# Altium project Reconfigurable_Test_Fixture.PrjPcb
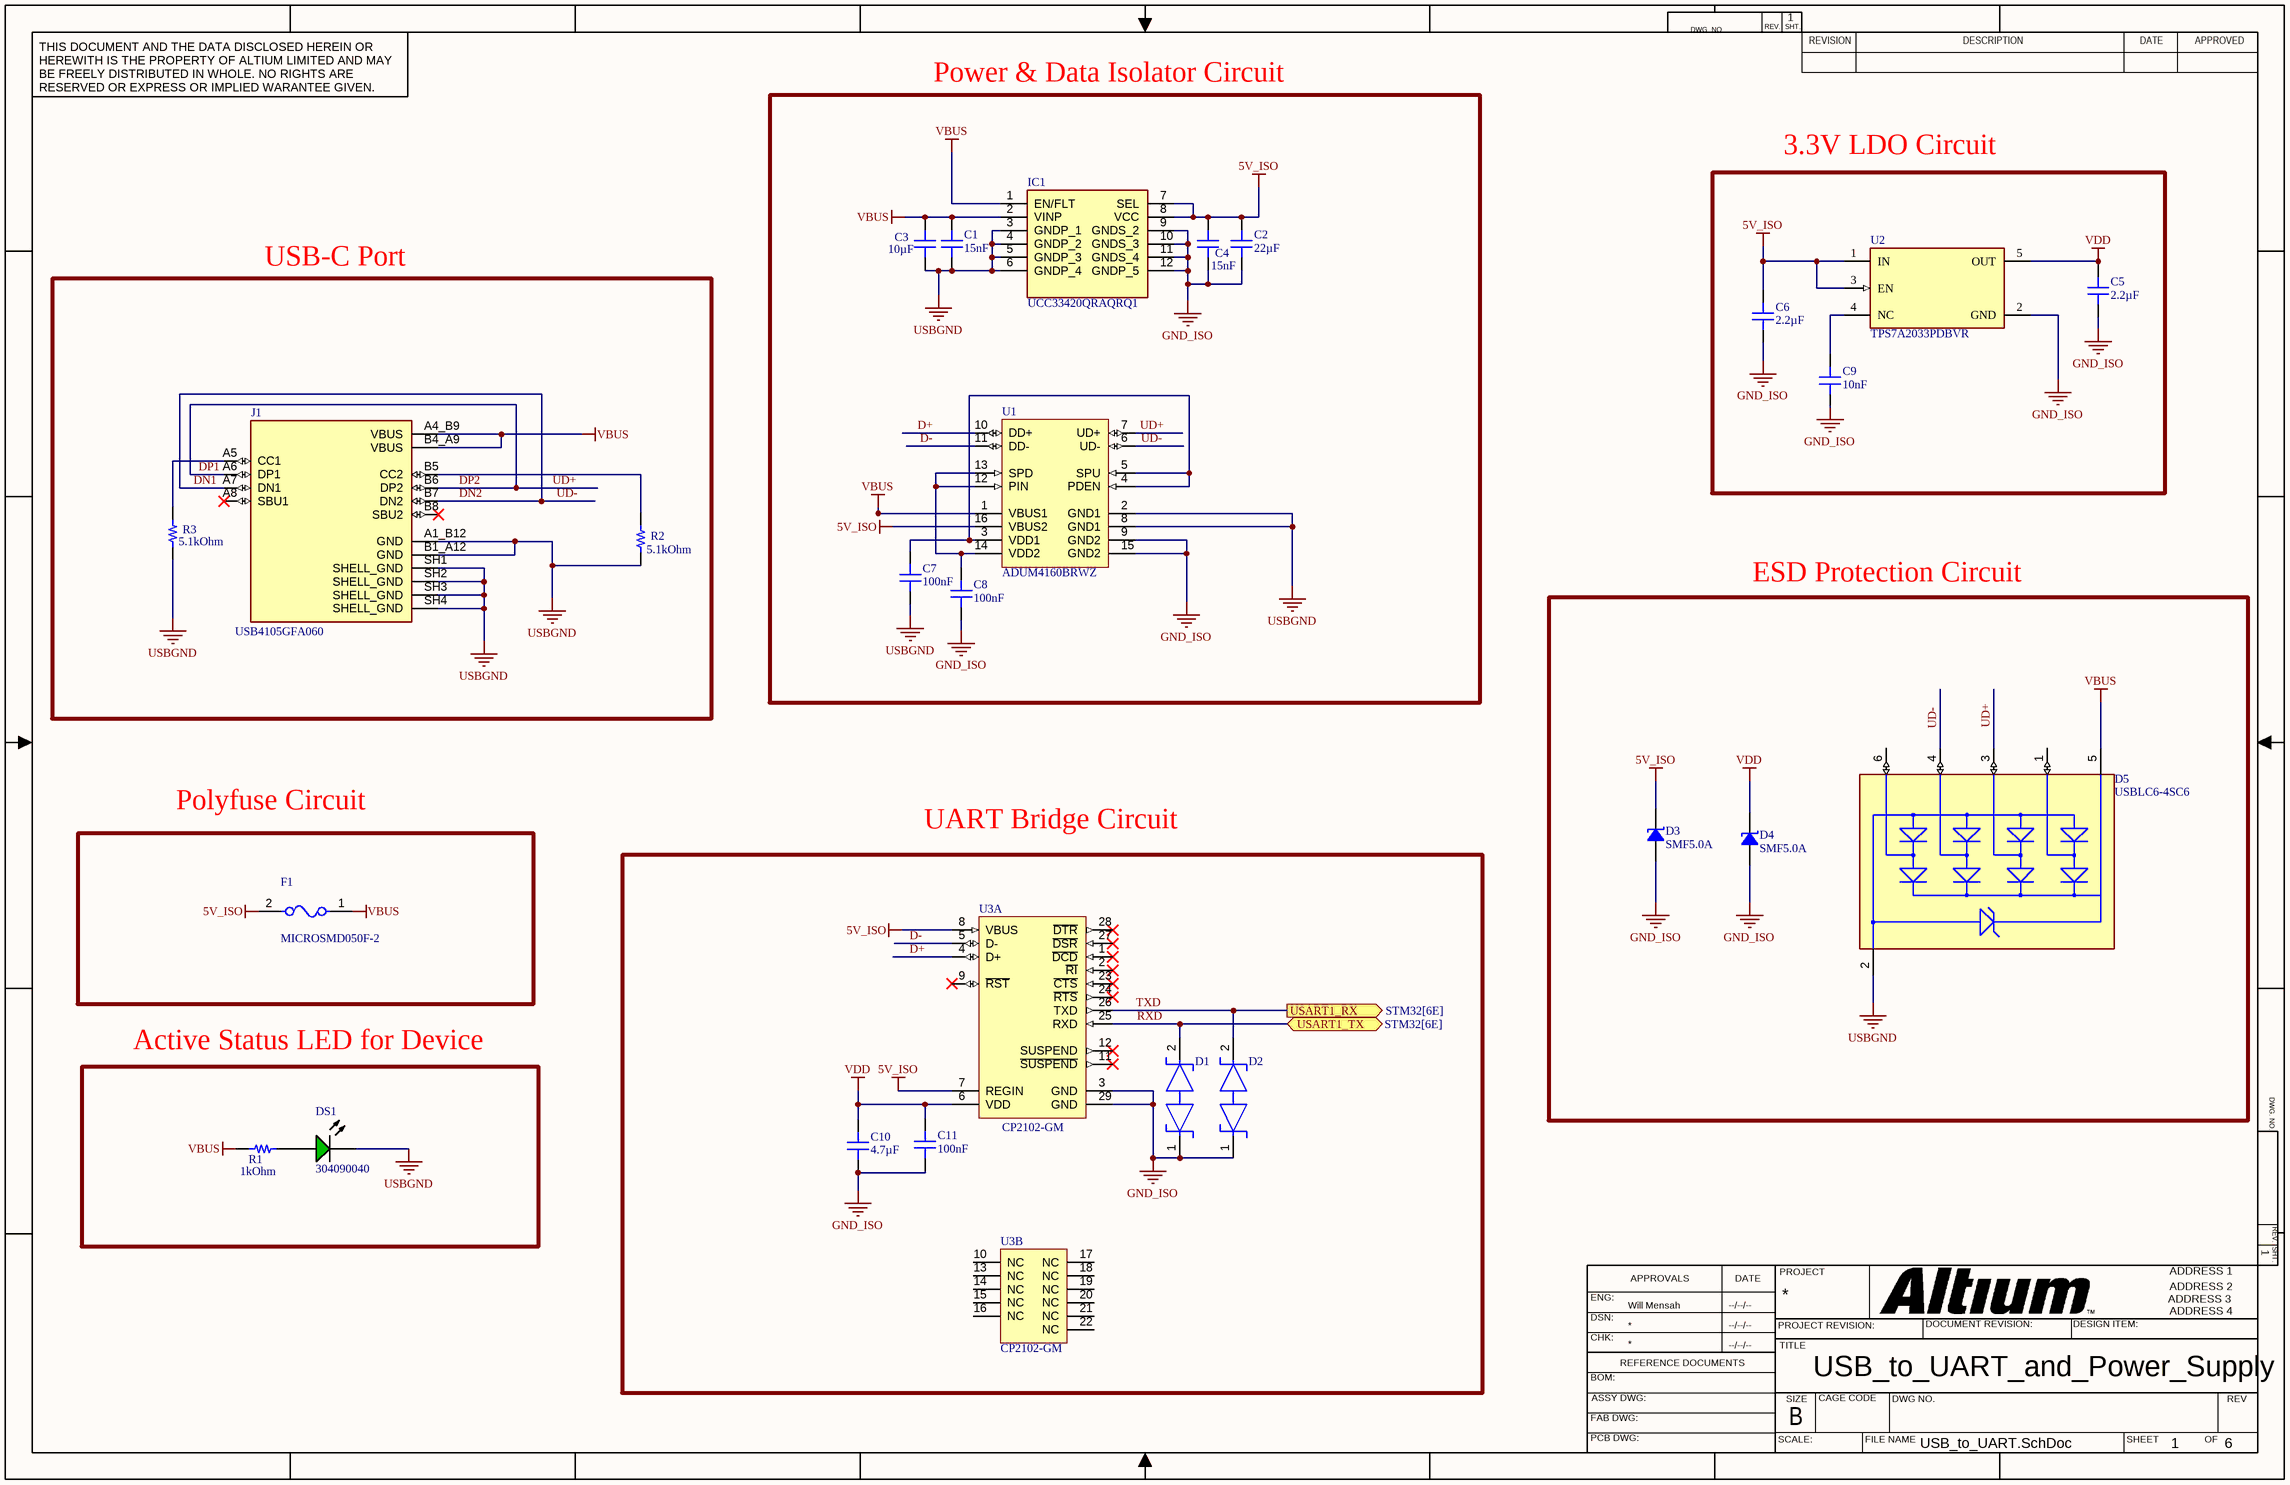
[diagram p0: USB_to_UART.SchDoc]
5 sheets, 107 parts. Net scope: flat (ports and power ports of the same name join across sheets).
Board file: PCB_1.PcbDoc
Sheets:
  USB_to_UART.SchDoc
  STM32.SchDoc
  Analog_Switch_Arrays.SchDoc
  Muxes_and_ADC.SchDoc
  Voltage_Reference_Circuit.SchDoc

## Sheet USB_to_UART.SchDoc: USB_to_UART_and_Power_Supply
size 431 x 279 mm; Engineer: Will Mensah; Organization: ORGANIZATION; Address1: ADDRESS 1; Address2: ADDRESS 2; Address3: ADDRESS 3; Address4: ADDRESS 4; Revision: -; SheetNumber: 1; SheetTotal: 6; ENG_APP_DATE: --/--/--; DSN_APP_DATE: --/--/--; CHK_APP_DATE: --/--/--

### Parts
C1  value 15nF  [CAP 1206_3216 - 0.8MM]  (hidden comment: 885342208013)
C2  value 22µF  [MURATA - GRM32E]  (hidden comment: GRM32ER71E226ME15L)
C3  value 10µF  [MURATA - GRM32E]  (hidden comment: GRM32ER71H106MA12L)
C4  value 15nF  [CAP 1206_3216 - 0.8MM]  (hidden comment: 885342208013)
C5  value 2.2µF  [MURATA CAP GCM31M 1206_3216]  (hidden comment: GCM31CL8EL225KE07L)
C6  value 2.2µF  [MURATA CAP GCM31M 1206_3216]  (hidden comment: GCM31CL8EL225KE07L)
C7  value 100nF  [MURATA CAP GCM31M 1206_3216]  (hidden comment: GCM31C5C1H104FA16L)
C8  value 100nF  [MURATA CAP GCM31M 1206_3216]  (hidden comment: GCM31C5C1H104FA16L)
C9  value 10nF  [MURATA CAP GRM31B 1206_3216]  (hidden comment: GRM31B7U2E103JW31L)
C10  value 4.7µF  [MURATA GRM21B 0805_2012]  (hidden comment: GRM21BR71A475KE51L)
C11  value 100nF  [MURATA CAP GCM31M 1206_3216]  (hidden comment: GCM31C5C1H104FA16L)
D1  TPD1E10B06DPYR  [FP-DPY0002A-MFG]  (value not drawn)
D2  TPD1E10B06DPYR  [FP-DPY0002A-MFG]  (value not drawn)
D3  SMF5.0A  [SOD123F]
D4  SMF5.0A  [SOD123F]
D5  USBLC6-4SC6  [FP-SOT23-6L-MFG]
DS1  304090040  [LED-2P-2.28-3MM]
F1  MICROSMD050F-2  [FP-microSMD-MFG]
IC1  UCC33420QRAQRQ1  [UCC33020QRAQRQ1]
J1  USB4105GFA060  [GCT_USB4105GFA060]
R1  1kOhm  [YAGEO RES 1206_3216]
R2  5.1kOhm  [YAGEO RES 1206_3216]
R3  5.1kOhm  [YAGEO RES 1206_3216]
U1  ADUM4160BRWZ  [RW-16_L]
U2  TPS7A2033PDBVR  [FP-DBV0005A-MFG]
U3  CP2102-GM  [SLAB-QFN-28-3125x3125TP_N]  (parts A,B of 2)

### Blocks framed on the sheet
Power & Data Isolator Circuit: C1-C4 C7 C8 IC1 U1
3.3V LDO Circuit: C5 C6 C9 U2
USB-C Port: J1 R2 R3
ESD Protection Circuit: D3-D5
Polyfuse Circuit: F1
UART Bridge Circuit: C10 C11 D1 D2 U3
Active Status LED for Device: DS1 R1

### Ports
USART1_RX (out, see STM32[6E]), USART1_TX (bidir, see STM32[6E])

### Nets
5V_ISO: C2.2 C4.2 C6.2 D3.2 F1.2 IC1.7(SEL) IC1.8(VCC) U1.16(VBUS2) U2.1(IN) U2.3(EN) U3.7(REGIN) U3.8(VBUS)
GND_ISO: C2.1 C4.1 C5.1 C6.1 C8.1 C9.1 C10.1 C11.1 D1.1 D2.1 D3.1 D4.1 IC1.9(GNDS_2) IC1.10(GNDS_3) IC1.11(GNDS_4) IC1.12(GNDP_5) U1.9(GND2) U1.15(GND2) U2.2(GND) U3.3(GND) U3.29(GND)
USBGND: C1.1 C3.1 C7.1 D5.2(GND) DS1.2(K) IC1.3(GNDP_1) IC1.4(GNDP_2) IC1.5(GNDP_3) IC1.6(GNDP_4) J1.A1_B12(GND) J1.B1_A12(GND) J1.SH1(SHELL_GND) J1.SH2(SHELL_GND) J1.SH3(SHELL_GND) J1.SH4(SHELL_GND) R2.1 R3.2 U1.2(GND1) U1.8(GND1)
VBUS: C1.2 C3.2 D5.5(VBUS) F1.1 IC1.1(EN/FLT) IC1.2(VINP) J1.A4_B9(VBUS) J1.B4_A9(VBUS) R1.2 U1.1(VBUS1)
VDD: C5.2 C10.2 C11.2 D4.2 U2.5(OUT) U3.6(VDD)
D+: U1.10(DD+) U3.4(D+)
D-: U1.11(DD-) U3.5(D-)
DN1: D5.4(I/O3) J1.A7(DN1) J1.B7(DN2) U1.6(UD-)  [also labelled DN2, UD-]
DP1: D5.3(I/O2) J1.A6(DP1) J1.B6(DP2) U1.7(UD+)  [also labelled DP2, UD+]
RXD: D1.2 U3.25(RXD) ; port USART1_TX
TXD: D2.2 U3.26(TXD) ; port USART1_RX
NetC7_2: C7.2 U1.3(VDD1) U1.4(PDEN) U1.5(SPU)
NetC8_2: C8.2 U1.12(PIN) U1.13(SPD) U1.14(VDD2)
NetC9_2: C9.2 U2.4(NC)
NetDS1_1: DS1.1(A) R1.1
NetJ1_A5: J1.A5(CC1) R3.1
NetJ1_B5: J1.B5(CC2) R2.2

Not connected (* = marked no-connect by the designer): D5 1(I/O1) 6(I/O4); J1 A8(SBU1)* B8(SBU2)*; U3 1(~{DCD})* 2(~{RI})* 9(~{RST})* 10(NC) 11(~{SUSPEND})* 12(SUSPEND)* 13(NC) 14(NC) 15(NC) 16(NC) 17(NC) 18(NC) 19(NC) 20(NC) 21(NC) 22(NC) 23(~{CTS})* 24(~{RTS})* 27(~{DSR})* 28(~{DTR})*

### Notes on the sheet
- DWG. NO.
- REV.
- SHT.
- THIS DOCUMENT AND THE DATA DISCLOSED HEREIN OR HEREWITH IS THE PROPERTY OF ALTIUM LIMITED AND MAY BE FREELY DISTRIBUTED IN WHOLE. NO RIGHTS ARE RESERVED OR EXPRESS OR IMPLIED WARANTEE GIVEN.
- REVISION
- DESCRIPTION
- DATE
- APPROVED
- ENG:
- APPROVALS
- PROJECT
- DSN:
- CHK:
- REFERENCE DOCUMENTS
- PROJECT REVISION:
- TITLE
- DOCUMENT REVISION:
- DESIGN ITEM:
- BOM:
- FAB DWG:
- PCB DWG:
- ASSY DWG:
- SCALE:
- SIZE
- B
- CAGE CODE
- FILE NAME
- DWG NO.
- SHEET
- OF
- REV

### Library data of the parts
C1 C4 = CMP-001-059796-1: CAP CER 15000PF 630V X7R 1206; Part Number: 885342208013
C2 = CMP-001-068110-1: CAP CER 22UF 25V X7R 1210; Part Number: GRM32ER71E226ME15L
C3 = CMP-001-068673-1: CAP CER 10UF 50V X7R 1210; Part Number: GRM32ER71H106MA12L
C5 C6 = CMP-001-063237-1: CAP CER 2.2UF 100V X8L 1206; Part Number: GCM31CL8EL225KE07L
C7 C8 C11 = CMP-001-060542-1: CAP CER 0.1UF 50V C0G/NP0 1206; Part Number: GCM31C5C1H104FA16L
C9 = CMP-001-062663-1: CAP CER 10000PF 250V U2J 1206; Part Number: GRM31B7U2E103JW31L
C10 = CMP-001-052117-1: CAP CER 4.7UF 10V X7R 0805; Part Number: GRM21BR71A475KE51L
D1 D2 = CMP-0326-00004-4: TVS DIODE 5.5V 14V 2X1SON; Manufacturer: Texas Instruments; Leakage Current: 100nA; Min Breakdown Voltage: 6V; Number of Channels: 1; ESD Protection: Yes; Power Line Protection: No; Test Current: 1mA; Interface: GPIO; Element Configuration: Single; Peak Pulse Current: 5A; Direction: Bidirectional; Peak Pulse Power: 90W; Capacitance: 12pF; Composition: Zener; Packaging: Tape and Reel; Number of Pins: 2; Breakdown Voltage: 6V; Radiation Hardening: No; Min Operating Temperature: -40°C; Contact Plating: Gold; Lead Free: Lead Free; Height: 0.35mm; REACH SVHC: No SVHC; Case/Package: 0402; Max Operating Temperature: 125°C; Width: 0.7mm; Clamping Voltage: 14V; Package Quantity: 1; Max Reverse Leakage Current: 100nA; Working Voltage: 5.5V; Length: 1.1mm; Number of Bidirectional Channels: 1; Reverse Standoff Voltage: 5.5V; PartNumber: TPD1E10B06DPYR
D3 D4 = CMP-004-19987-1: TVS SOD123FL 5V 200W UNIDIR; Part Number: SMF5.0A
D5 = CMP-2000-07370-2: TVS DIODE 5.25V 17V SOT23-6; Manufacturer: STMicroelectronics; Peak Pulse Power: 130W; Breakdown Voltage: 6V; Value: 3pF; Direction: Unidirectional; Interface: USB,Ethernet,Other; Number Of Channels: 4; Standoff Height: 0mm; Max Junction Temp: +125°C; Digikey Description: TVS DIODE 5.25V 17V SOT23-6; Automotive: No; Package: SOT23-6L; Mouser Description: USBLC6 Series 4 Line 6 V Uni / Bi-Directional ESD Protection - SOT-23-6; Octopart: https://octopart.com/usblc6-4sc6-stmicroelectronics-347147; RoHS: TRUE; ComponentLink2URL: https://upverter.com/datasheet/23dc4ffb028d868909e80577610284b194f13213.pdf; ComponentLink2Description: Datasheet; Device Class L1: Circuit Protection; Lead Free: Yes; Temperature Range High: +125°C; Device Class L2: ESD and Circuit Protection ICs; Device Class L3: unset; Capacitance: 3pF; Height: 1.45mm; Temperature Range Low: -40°C; Manufacturer Part Number: USBLC6-4SC6; Temperature: -40°C to +125°C; Category: Diode; Clamping Voltage: 17V
DS1 = CMP-007-00006-2: Green LED, 80 mW, 20 mA, -25 to 85 degC, 2-Pin THD; Manufacturer: Shenzhen CGX; Manufacturer URL: http://szcgx.com/; Package Reference: 304090040; Datasheet Version: Rev. 1.0, 09/2014; RoHS Compliant: Unknown; Case/Package: 304090040; Package Description: 2-Pin Through Hole Device, Dia 3 mm, Pitch 2.28 mm; Datasheet URL: http://datasheet.octopart.com/304090040-Chengguangxing-datasheet-62330655.pdf; Mounting Technology: TH
F1 = CMP-08606-000015-1: PTC RESET FUSE 13.2V 500MA 1210; Manufacturer: Littelfuse; Hold Current: 0.5A; Resistance: 0.25-0.9Ω; Trip Time: 0.05s; Value: 0.25-0.9Ω; Trip Current: 1A; Current Rating: 40A; Device Class L3: unset; ComponentLink2URL: https://www.littelfuse.com/~/media/electronics/datasheets/resettable_ptcs/littelfuse_ptc_microsmd_datasheet.pdf.pdf; Temperature: to +85°C; ComponentLink2Description: Datasheet; RoHS: TRUE; Category: Fuse; Ambient Temperature Range Low: -40°C; Lead Free: Yes; Device Class L1: Circuit Protection; Manufacturer Part Number: MICROSMD050F-2; Temperature Range High: +85°C; Ambient Temperature Range High: +85°C; Automotive: No; Height: 0.62mm; Digikey Description: PTC RESET FUSE 13.2V 500MA 1210; Voltage Rating: 13.2V; Package: microSMD; Octopart: https://octopart.com/microsmd050f-2-littelfuse-74214982; Device Class L2: PTC Resettable Fuses
IC1 = UCC33420QRAQRQ1: Integrated Circuit; Manufacturer_Name: Texas Instruments; Datasheet Link: https://www.ti.com/lit/ds/symlink/ucc33420-q1.pdf?ts=1741595347894&ref_url=https%253A%252F%252Fwww.ti.com%252Fproduct%252FUCC33420-Q1; Height: 1.05mm; Manufacturer_Part_Number: UCC33420QRAQRQ1; Mouser Part Number: 595-UCC33420QRAQRQ1; Mouser Price/Stock: https://www.mouser.co.uk/ProductDetail/Texas-Instruments/UCC33420QRAQRQ1?qs=7%2F6SraaimPSitAwgIt4uJA%3D%3D; Arrow Part Number: UCC33420QRAQRQ1; Arrow Price/Stock: https://www.arrow.com/en/products/ucc33420qraqrq1/texas-instruments?utm_currency=USD&region=nac
J1 = CMP-002-00267-1: USB-C (USB TYPE-C) USB 2.0 Receptacle Connector 24 (16+8 Dummy) Position Surface Mount, Right Angle; Through Hole; MF: Global Connector Technology; Check_prices: https://www.snapeda.com/parts/USB4105GFA060/Global+Connector+Technology/view-part/?ref=eda; Component Type: Standard; Source: USB4105GFA060.SchLib; SnapEDA_Link: https://www.snapeda.com/parts/USB4105GFA060/Global+Connector+Technology/view-part/?ref=snap; Pins: 16; Case/Package: None; Design Item ID: USB4105GFA060; Value: *; MP: USB4105GFA060
R1 = CMP-009-085524-1: RES 1K OHM 1% 1/4W 1206; Part Number: RC1206FR-101KL
R2 R3 = CMP-009-086345-1: RES 5.1K OHM 0.1% 1/4W 1206; Part Number: RP1206BRD075K1L
U1 = CMP-0534-00647-1: Full/Low Speed USB Digital Isolator, 2 Channels, 5 kV rms, 3.1 to 5.5 V, -40 to 105 degC, 16-Pin SOIC (RW-16), RoHS, Tube; Manufacturer: Analog Devices; IDD@12 Mbps: 8 mA Max.; Number of Channels: 2; Data Rate: 12 Mbps Max.; CIN: 10 pF Typ.; Voltage Isolation: 5 kVrms; DatasheetVersion: Rev. D; VBUS: 3.1 to 5.5 V; PartNumber: ADUM4160BRWZ; Temperature Range: -40 to 105 degC; Mounting Technology: Surface Mount; PackageDescription: 16-Pin Small Outline Integrated Circuit, Body 10.3 x 7.5 mm, Pitch 1.27 mm; ComponentLink2URL: http://www.analog.com/static/imported-files/data_sheets/ADuM4160.pdf; PackageVersion: Mar-07; ComponentLink2Description: Datasheet; ComponentLink1URL: http://www.analog.com/en/index.html; Packing: Tube; ComponentLink3URL: http://www.analog.com/static/imported-files/packages/PKG_PDF/SOIC_WIDE%20(RW)/RW_16.pdf; RoHS: TRUE; ComponentLink3Description: Package Specification; ComponentLink1Description: Manufacturer URL
U2 = CMP-04917-000300-1: IC REG LINEAR 3.3V 300MA SOT23-5; RoHS Compliant: Yes
U3 = CMP-0511-00012-1: Single-Chip USB to UART Bridge, 1024 Bytes EEPROM, -40 to 85 degC, 28-pin QFN, Tube; Manufacturer: Silicon Labs; Internal Oscillator: TRUE; Sub-Family: USB Bridges; ComponentLink3Description: Package Specification; PackageDescription: 28-Pin Quad-Flat No-Leads Package, Body 5 x 5 mm, Pitch 0.5 mm; PartNumber: CP2102-GM; EEPROM: 1024 Bytes; Mounting Technology: Surface Mount; ComponentLink2URL: http://www.silabs.com/Support%20Documents/TechnicalDocs/CP2102-9.pdf; DatasheetVersion: Rev. 1.5; ComponentLink1URL: http://www.silabs.com/; ComponentLink2Description: Datasheet; Code_JEDEC: MO-220; PackageReference: QFN-28; Code_IPC: J-STD-020C; ComponentLink3URL: http://www.silabs.com/Support%20Documents/TechnicalDocs/C8051T61x.pdf; ComponentLink1Description: Manufacturer URL

## Sheet STM32.SchDoc: STM32_and_Reference_Voltage_Circuits
size 431 x 279 mm; DrawnBy: Will Mensah; SheetNumber: 2; SheetTotal: 6
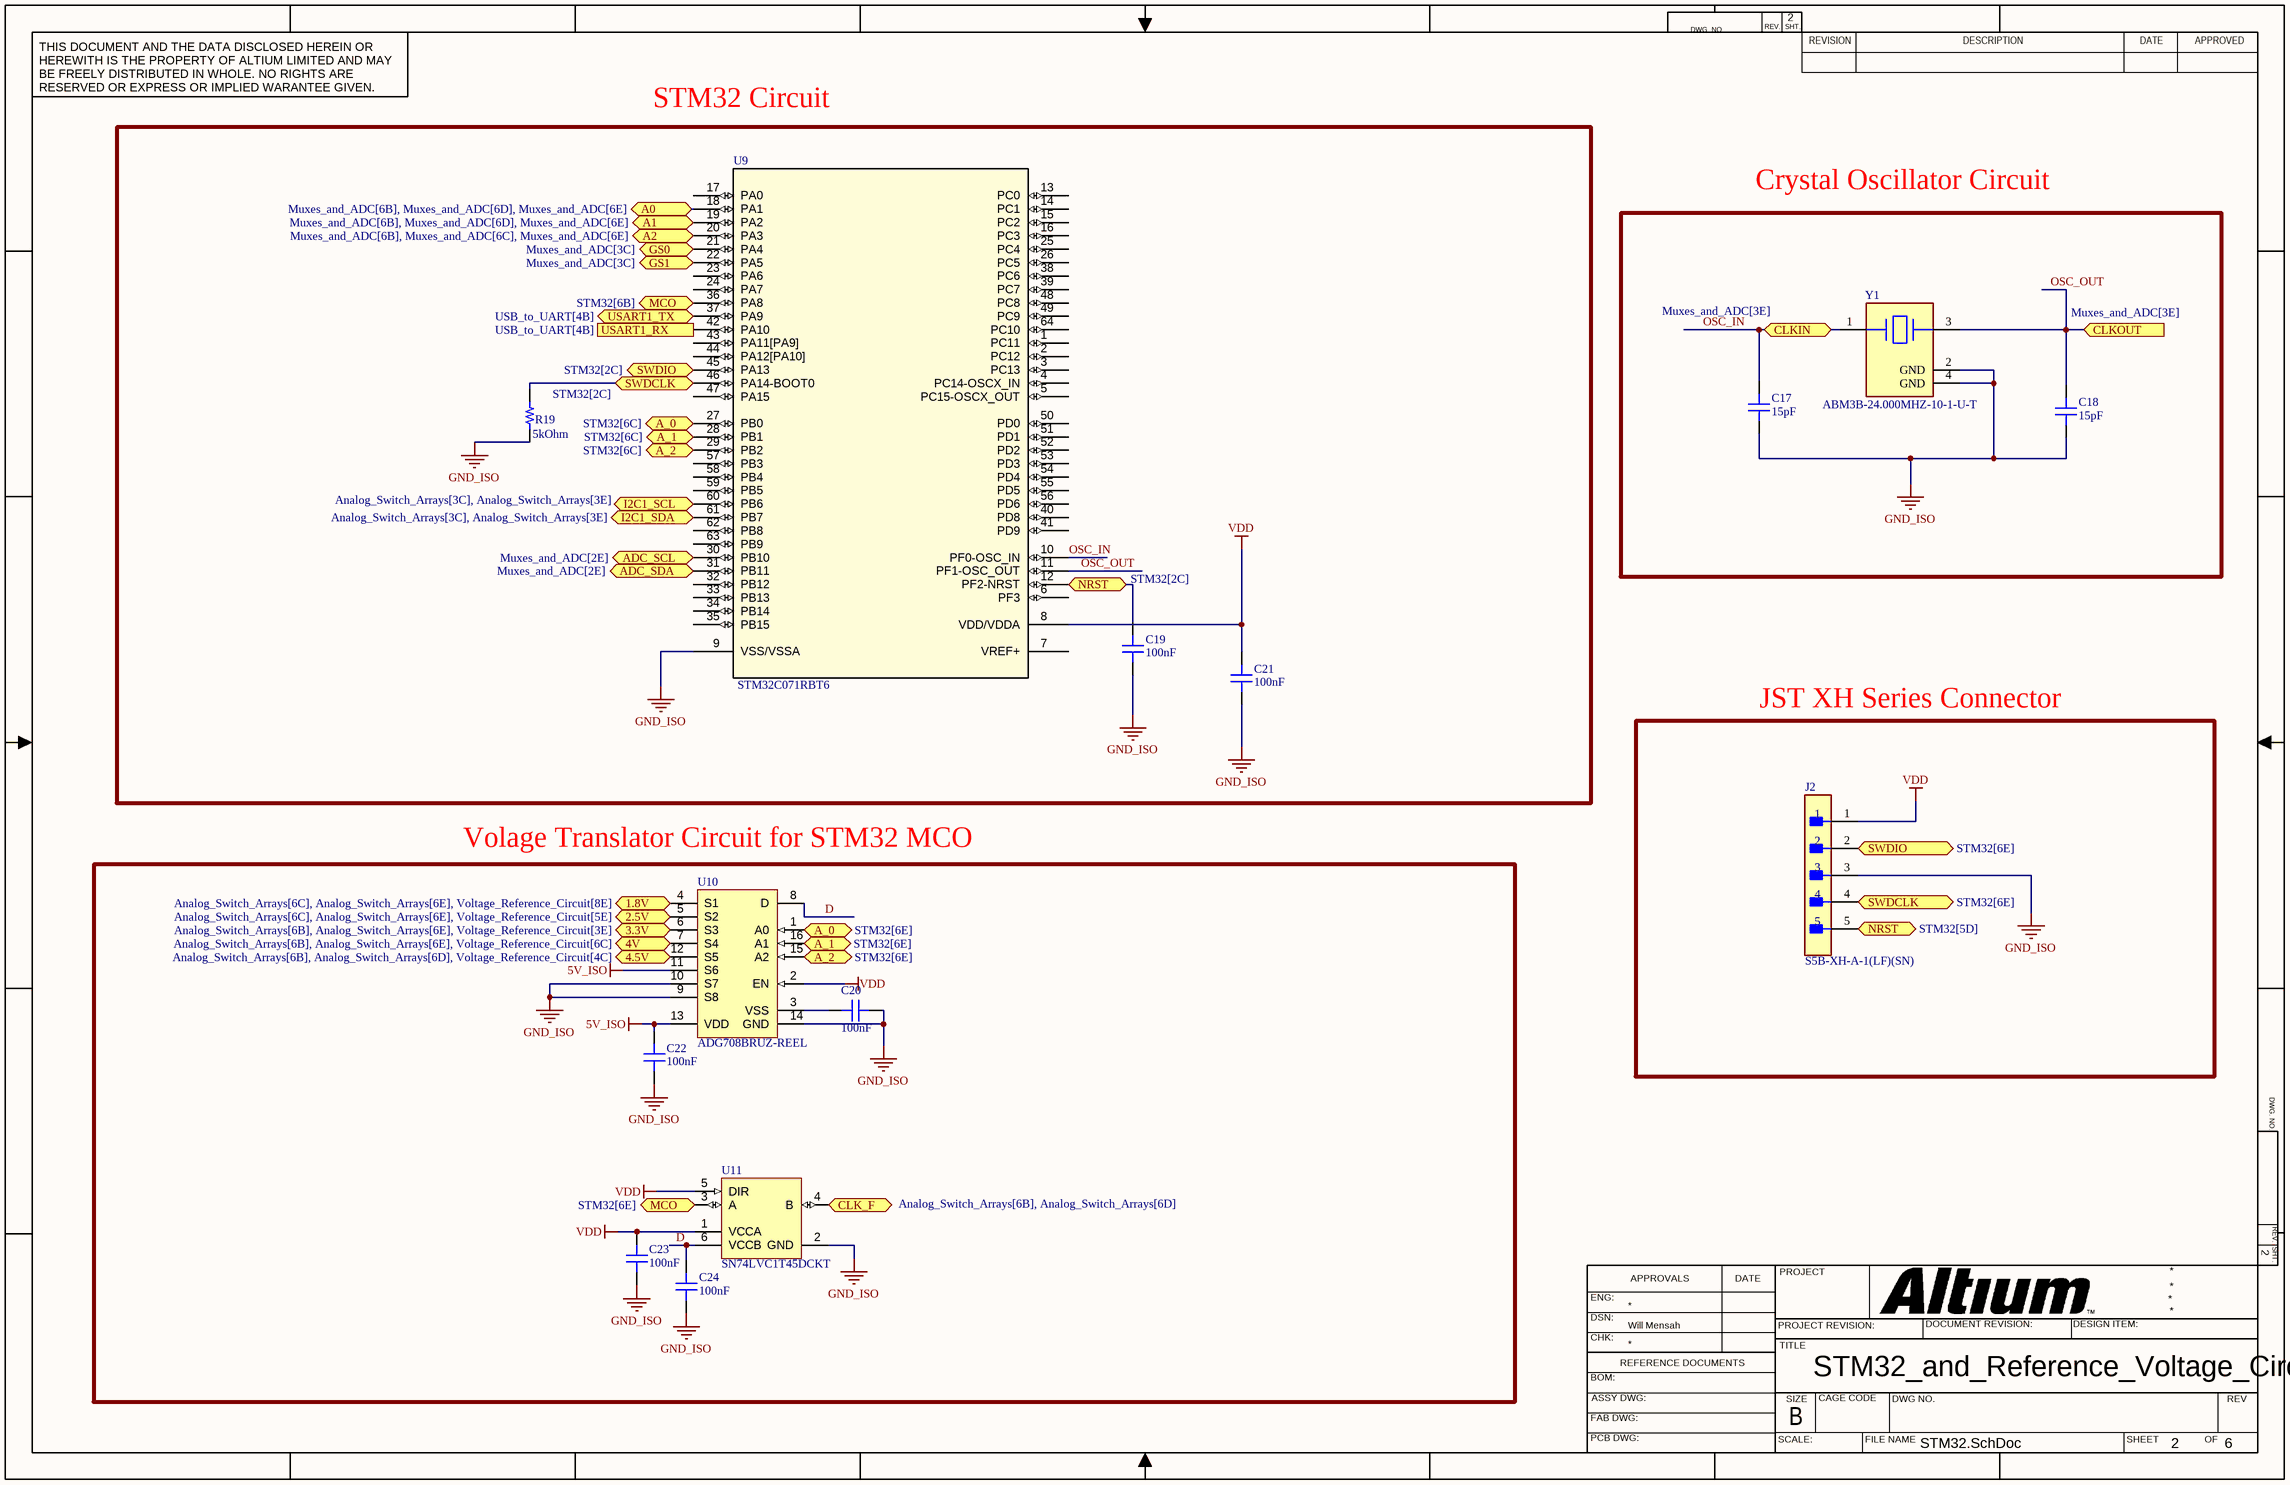
[diagram p1: STM32.SchDoc]

### Parts
C17  value 15pF  [MURATA CAP GRM31A 1206_3216]  (hidden comment: GRM31A5C2H150JW01D)
C18  value 15pF  [MURATA CAP GRM31A 1206_3216]  (hidden comment: GRM31A5C2H150JW01D)
C19  value 100nF  [MURATA CAP GCM31M 1206_3216]  (hidden comment: GCM31C5C1H104FA16L)
C20  value 100nF  [CAP 1206_3216 - 0.8MM]  (hidden comment: C1206X104G4HAC7800)
C21  value 100nF  [MURATA CAP GCM31M 1206_3216]  (hidden comment: GCM31C5C1H104FA16L)
C22  value 100nF  [CAP 1206_3216 - 0.8MM]  (hidden comment: C1206X104G4HAC7800)
C23  value 100nF  [CAP 1206_3216 - 0.8MM]  (hidden comment: C1206X104G4HAC7800)
C24  value 100nF  [CAP 1206_3216 - 0.8MM]  (hidden comment: C1206X104G4HAC7800)
J2  S5B-XH-A-1(LF)(SN)  [FP-S5B-XH-A-1_LF_SN-MFG]
R19  5kOhm  [YAGEO RES 1206_3216]
U9  STM32C071RBT6  [LQFP-64_STM]
U10  ADG708BRUZ-REEL  [ADI-RU-16_N]
U11  SN74LVC1T45DCKT  [DCK0006A_N]
Y1  ABM3B-24.000MHZ-10-1-U-T  [FP-ABM3B-MFG]

### Blocks framed on the sheet
STM32 Circuit: C19 C21 R19 U9
Crystal Oscillator Circuit: C17 C18 Y1
JST XH Series Connector: J2
Volage Translator Circuit for STM32 MCO: C20 C22-C24 U10 U11

### Ports
1.8V (bidir, see Analog_Switch_Arrays[6C], Analog_Switch_Arrays[6E], Voltage_Reference_Circuit[8E]), 2.5V (bidir, see Analog_Switch_Arrays[6C], Analog_Switch_Arrays[6E], Voltage_Reference_Circuit[5E]), 3.3V (bidir, see Analog_Switch_Arrays[6B], Analog_Switch_Arrays[6E], Voltage_Reference_Circuit[3E]), 4.5V (bidir, see Analog_Switch_Arrays[6B], Analog_Switch_Arrays[6D], Voltage_Reference_Circuit[4C]), 4V (bidir, see Analog_Switch_Arrays[6B], Analog_Switch_Arrays[6E], Voltage_Reference_Circuit[6C]), A0 (bidir, see Muxes_and_ADC[6B], Muxes_and_ADC[6D], Muxes_and_ADC[6E]), A1 (bidir, see Muxes_and_ADC[6B], Muxes_and_ADC[6D], Muxes_and_ADC[6E]), A2 (bidir, see Muxes_and_ADC[6B], Muxes_and_ADC[6C], Muxes_and_ADC[6E]), A_0 (bidir, see STM32[6C]), A_0 (bidir, see STM32[6E]), A_1 (bidir, see STM32[6C]), A_1 (bidir, see STM32[6E]), A_2 (bidir, see STM32[6C]), A_2 (bidir, see STM32[6E]), ADC_SCL (bidir, see Muxes_and_ADC[2E]), ADC_SDA (bidir, see Muxes_and_ADC[2E]), CLK_F (bidir, see Analog_Switch_Arrays[6B], Analog_Switch_Arrays[6D]), CLKIN (bidir, see Muxes_and_ADC[3E]), CLKOUT (in, see Muxes_and_ADC[3E]), GS0 (bidir, see Muxes_and_ADC[3C]), GS1 (bidir, see Muxes_and_ADC[3C]), I2C1_SCL (bidir, see Analog_Switch_Arrays[3C], Analog_Switch_Arrays[3E]), I2C1_SDA (bidir, see Analog_Switch_Arrays[3C], Analog_Switch_Arrays[3E]), MCO (bidir, see STM32[6B]), MCO (bidir, see STM32[6E]), NRST (bidir, see STM32[2C]), NRST (bidir, see STM32[5D]), SWDCLK (bidir, see STM32[2C]), SWDCLK (bidir, see STM32[6E]), SWDIO (bidir, see STM32[2C]), SWDIO (bidir, see STM32[6E]), USART1_RX (in, see USB_to_UART[4B]), USART1_TX (bidir, see USB_to_UART[4B])

### Nets
5V_ISO: C22.1 U10.11(S6) U10.13(VDD)
GND_ISO: C17.1 C18.2 C19.1 C20.2 C21.1 C22.2 C23.1 C24.1 J2.3 R19.1 U9.9(VSS/VSSA) U10.9(S8) U10.10(S7) U10.14(GND) U11.2(GND) Y1.2(GND) Y1.4(GND)
VDD: C21.2 C23.2 J2.1 U9.8(VDD/VDDA) U10.2(EN) U11.1(VCCA) U11.5(DIR)
2Y0: U10.4(S1) ; port 1.8V
2Y1: U10.5(S2) ; port 2.5V
2Y2: U10.6(S3) ; port 3.3V
2Y3: U10.7(S4) ; port 4V
2Y4: U10.12(S5) ; port 4.5V
2Y6: U11.4(B) ; port CLK_F
D: C24.2 U10.8(D) U11.6(VCCB)
OSC_IN: C17.2 U9.10(PF0-OSC_IN) Y1.1 ; port CLKIN
OSC_OUT: C18.1 U9.11(PF1-OSC_OUT) Y1.3 ; port CLKOUT
RXD: U9.37(PA9) ; port USART1_TX
SCLK: U9.30(PB10) ; port ADC_SCL
SDIO: U9.31(PB11) ; port ADC_SDA
TXD: U9.42(PA10) ; port USART1_RX
NetC19_2: C19.2 J2.5 U9.12(PF2-NRST) ; port NRST
NetC20_1: C20.1 U10.3(VSS)
NetJ2_2: J2.2 U9.45(PA13) ; port SWDIO
NetJ2_4: J2.4 R19.2 U9.46(PA14-BOOT0) ; port SWDCLK
NetR21_1: U9.60(PB6) ; port I2C1_SCL
NetR22_1: U9.61(PB7) ; port I2C1_SDA
NetU9_18: U9.18(PA1) ; port A0
NetU9_19: U9.19(PA2) ; port A1
NetU9_20: U9.20(PA3) ; port A2
NetU9_21: U9.21(PA4) ; port GS0
NetU9_22: U9.22(PA5) ; port GS1
NetU9_27: U9.27(PB0) U10.1(A0) ; port A_0
NetU9_28: U9.28(PB1) U10.16(A1) ; port A_1
NetU9_29: U9.29(PB2) U10.15(A2) ; port A_2
NetU9_36: U9.36(PA8) U11.3(A) ; port MCO

Not connected (* = marked no-connect by the designer): U9 1(PC11) 2(PC12) 3(PC13) 4(PC14-OSCX_IN) 5(PC15-OSCX_OUT) 6(PF3) 7(VREF+) 13(PC0) 14(PC1) 15(PC2) 16(PC3) 17(PA0) 23(PA6) 24(PA7) 25(PC4) 26(PC5) 32(PB12) 33(PB13) 34(PB14) 35(PB15) 38(PC6) 39(PC7) 40(PD8) 41(PD9) 43(PA11[PA9]) 44(PA12[PA10]) 47(PA15) 48(PC8) 49(PC9) 50(PD0) 51(PD1) 52(PD2) 53(PD3) 54(PD4) 55(PD5) 56(PD6) 57(PB3) 58(PB4) 59(PB5) 62(PB8) 63(PB9) 64(PC10)

### Notes on the sheet
- DWG. NO.
- REV.
- SHT.
- THIS DOCUMENT AND THE DATA DISCLOSED HEREIN OR HEREWITH IS THE PROPERTY OF ALTIUM LIMITED AND MAY BE FREELY DISTRIBUTED IN WHOLE. NO RIGHTS ARE RESERVED OR EXPRESS OR IMPLIED WARANTEE GIVEN.
- REVISION
- DESCRIPTION
- DATE
- APPROVED
- ENG:
- APPROVALS
- PROJECT
- DSN:
- CHK:
- REFERENCE DOCUMENTS
- PROJECT REVISION:
- TITLE
- DOCUMENT REVISION:
- DESIGN ITEM:
- BOM:
- FAB DWG:
- PCB DWG:
- ASSY DWG:
- SCALE:
- SIZE
- B
- CAGE CODE
- FILE NAME
- DWG NO.
- SHEET
- OF
- REV

### Library data of the parts
C17 C18 = CMP-001-059711-1: CAP CER 15PF 500V C0G/NP0 1206; Part Number: GRM31A5C2H150JW01D
C19 C21 = CMP-001-060542-1: CAP CER 0.1UF 50V C0G/NP0 1206; Part Number: GCM31C5C1H104FA16L
C20 C22-C24 = CMP-001-063573-1: CAP CER 1206 0.1F 16V ULTRA STAB; Part Number: C1206X104G4HAC7800
J2 = CMP-17439-000362-1: CONN HEADER R/A 5POS 2.5MM; Number of Positions: 5; Voltage Rating: 250V; Contact Shape: Square; Number of Rows: 1; Lead Free: Lead Free; Contact Material: Brass; Termination: Press-Fit; Connector Type: Header; Contact Finish - Mating: TIN; Insulation Color: Natural; Packaging: Bulk; Min Operating Temperature: -25°C; Series: XH; Mount: Through Hole; Contact Type: Male Pin; Insulation Material: Nylon; Max Operating Temperature: 85°C; Pitch: 2.5mm; Fastening Type: Detent; Flammability Rating: UL94 V-0
R19 = CMP-009-077766-1: RES SMD 5K OHM 0.1% 1/4W 1206; Part Number: RT1206BRD075KL
U9 = CMP-031-00033-1: Mainstream Arm Cortex-M0+ MCU with 128 Kbytes of Flash memory, 24 Kbytes RAM, 48 MHz CPU, 2x USART, timers, ADC, comm. I/F, USB FS, 2-3.6V; Manufacturer_Name: STMicroelectronics; Copyright: Copyright (C) 2025 Ultra Librarian. All rights reserved.; Component Type: Standard; Pins: 64; Source: STM32C071RBT6.SchLib; Type: Type; RefDes: RefDes; Manufacturer_Part_Number: STM32C071RBT6; Design Item ID: STM32C071RBT6
U10 = CMP-0798-00195-1: 1.8 to 5.5 V / +/-2.5 V, CMOS Low Voltage 3 Ohm, 8-Channel Multiplexer, -40 to 125 degC, 16-pin SOP (RU-16), Reel; Manufacturer: Analog Devices; t transition (s): 14n; Bandwidth (Hz): 55M; Supply V Guar Performance: Dual_(+/-2.5V), Single_(+3V), Single_(+5V); Ron (ohms): 3; Max Analog Signal Range: Vss to Vdd; ComponentLink1URL: http://www.analog.com/en/index.html; ComponentLink3Description: Package Specification; Code_JEDEC: MO-153AB; ComponentLink2URL: http://www.analog.com/static/imported-files/data_sheets/ADG708_709.pdf; Packing: Reel; ComponentLink3URL: http:/www.analog.com/static/imported-files/packages/36244347913743854010197452789RU16.pdf; PackageVersion: Nov-02; ComponentLink2Description: Datasheet; ComponentLink1Description: Manufacturer URL; PackageReference: RU-16; DatasheetVersion: Rev. C; PackageDescription: 16-Pin Thin Shrink Small Outline Package, Body 5 x 4.4 mm, Pitch 0.65 mm; PartNumber: ADG708BRUZ-REEL; Mounting Technology: Surface Mount
U11 = CMP-0859-00457-3: Single-Bit Dual-Supply Bus Transceiver with Configurable Voltage Translation and 3-State Outputs, DCK0006A, SMALL T&R; Manufacturer: Texas Instruments; VCC(Max)(V): 5.5; F @ Nom Voltage(Max)(Mhz): 150; 3-State Output: Yes; Output Type: CMOS; tpd @ Nom Voltage(Max)(ns): 15.5,8,5.8,4.4; Schmitt Trigger: No; Rating: Catalog; Logic: True; ICC @ Nom Voltage(Max)(mA): 0.004; VCC(Min)(V): 1.65; Technology Family: LVC; Input Type: CMOS/TTL; Voltage(Nom)(V): 1.8,2.5,3.3,5; Output Drive (IOL/IOH)(Max)(mA): 32/-32; Bits(#): 1; Sub-Family: Dual Supply Translator; PackageReference: DCK0006A; Generic Part Number: SN74LVC1T45; Operating Temperature Range(C): -40 to 85; DatasheetVersion: SCES515K
Y1 = CMP-27762-006050-1: Crystal 24MHz ±10ppm 10pF SMD-4 5mm x 3.2mm; ESR (Equivalent Series Resistance): 50R; Radiation Hardening: No; Frequency Tolerance: 10ppm; Mount: Surface Mount; Termination: SMD/SMT; Length: 5mm; Load Capacitance: 10pF; Frequency Stability: 10ppm; Min Operating Temperature: -10°C; Resistor Type: Ceramic; Depth: 3.2mm; Operating Frequency: 24 MHz; Lead Free: Lead Free; Series: ABM3B; Max Operating Temperature: 60°C; Frequency: 24MHz; RoHS Compliant: Yes; Width: 0.126inch; Packaging: Tape and Reel; Case/Package: CSMD; Package Quantity: 1000; REACH SVHC: No SVHC; Height: 0.043inch; Tolerance: 10ppm; Number of Pins: 4

## Sheet Analog_Switch_Arrays.SchDoc: Switch_Array_and_ZIF_Socket
size 431 x 279 mm; DrawnBy: Will Mensah; Organization: ORGANIZATION; Address1: ADDRESS 1; Address2: ADDRESS 2; Address3: ADDRESS 3; Address4: ADDRESS 4; Revision: -; SheetNumber: 3; SheetTotal: 6; ENG_APP_DATE: --/--/--; DSN_APP_DATE: --/--/--; CHK_APP_DATE: --/--/--
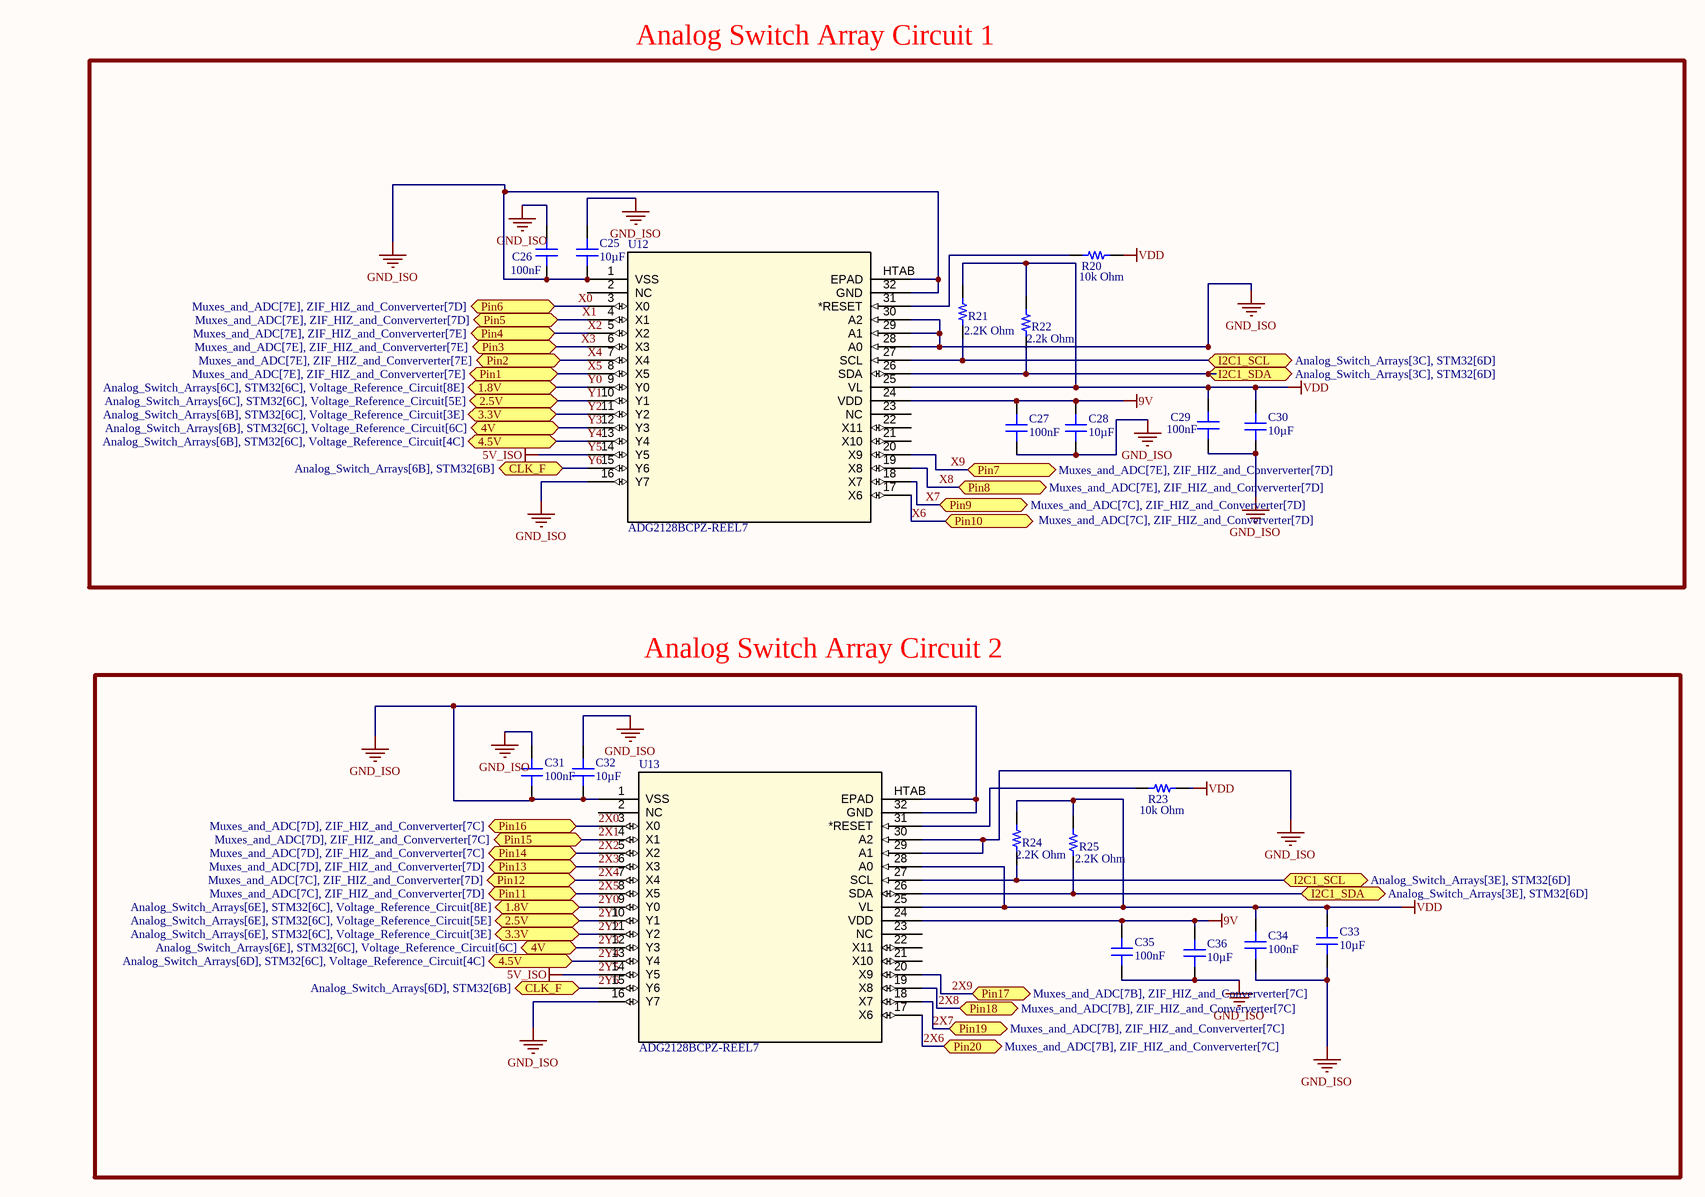
[diagram p2: Analog_Switch_Arrays.SchDoc]

### Parts
C25  value 10µF  [MURATA CAP GCM31M 1206_3216]  (hidden comment: GCM31CM8EG106KE08L)
C26  value 100nF  [CAP 1206_3216 - 0.8MM]  (hidden comment: C1206X104G4HAC7800)
C27  value 100nF  [CAP 1206_3216 - 0.8MM]  (hidden comment: C1206X104G4HAC7800)
C28  value 10µF  [MURATA CAP GCM31M 1206_3216]  (hidden comment: GCM31CM8EG106KE08L)
C29  value 100nF  [CAP 1206_3216 - 0.8MM]  (hidden comment: C1206X104G4HAC7800)
C30  value 10µF  [MURATA CAP GCM31M 1206_3216]  (hidden comment: GCM31CM8EG106KE08L)
C31  value 100nF  [CAP 1206_3216 - 0.8MM]  (hidden comment: C1206X104G4HAC7800)
C32  value 10µF  [MURATA CAP GCM31M 1206_3216]  (hidden comment: GCM31CM8EG106KE08L)
C33  value 10µF  [MURATA CAP GCM31M 1206_3216]  (hidden comment: GCM31CM8EG106KE08L)
C34  value 100nF  [CAP 1206_3216 - 0.8MM]  (hidden comment: C1206X104G4HAC7800)
C35  value 100nF  [CAP 1206_3216 - 0.8MM]  (hidden comment: C1206X104G4HAC7800)
C36  value 10µF  [MURATA CAP GCM31M 1206_3216]  (hidden comment: GCM31CM8EG106KE08L)
R20  10k Ohm  [YAGEO RES 1206_3216]
R21  2.2K Ohm  [RES 1210_3225]
R22  2.2k Ohm  [RES 1210_3225]
R23  10k Ohm  [YAGEO RES 1206_3216]
R24  2.2K Ohm  [RES 1210_3225]
R25  2.2K Ohm  [RES 1210_3225]
U12  ADG2128BCPZ-REEL7  [CP_32_7_ADI]
U13  ADG2128BCPZ-REEL7  [CP_32_7_ADI]

### Blocks framed on the sheet
Analog Switch Array Circuit 1: C25-C30 R20-R22 U12
Analog Switch Array Circuit 2: C31-C36 R23-R25 U13

### Ports
1.8V (bidir, see Analog_Switch_Arrays[6C], STM32[6C], Voltage_Reference_Circuit[8E]), 1.8V (bidir, see Analog_Switch_Arrays[6E], STM32[6C], Voltage_Reference_Circuit[8E]), 2.5V (bidir, see Analog_Switch_Arrays[6C], STM32[6C], Voltage_Reference_Circuit[5E]), 2.5V (bidir, see Analog_Switch_Arrays[6E], STM32[6C], Voltage_Reference_Circuit[5E]), 3.3V (bidir, see Analog_Switch_Arrays[6B], STM32[6C], Voltage_Reference_Circuit[3E]), 3.3V (bidir, see Analog_Switch_Arrays[6E], STM32[6C], Voltage_Reference_Circuit[3E]), 4.5V (bidir, see Analog_Switch_Arrays[6B], STM32[6C], Voltage_Reference_Circuit[4C]), 4.5V (bidir, see Analog_Switch_Arrays[6D], STM32[6C], Voltage_Reference_Circuit[4C]), 4V (bidir, see Analog_Switch_Arrays[6B], STM32[6C], Voltage_Reference_Circuit[6C]), 4V (bidir, see Analog_Switch_Arrays[6E], STM32[6C], Voltage_Reference_Circuit[6C]), CLK_F (bidir, see Analog_Switch_Arrays[6B], STM32[6B]), CLK_F (bidir, see Analog_Switch_Arrays[6D], STM32[6B]), I2C1_SCL (bidir, see Analog_Switch_Arrays[3C], STM32[6D]), I2C1_SCL (bidir, see Analog_Switch_Arrays[3E], STM32[6D]), I2C1_SDA (bidir, see Analog_Switch_Arrays[3C], STM32[6D]), I2C1_SDA (bidir, see Analog_Switch_Arrays[3E], STM32[6D]), Pin1 (bidir, see Muxes_and_ADC[7E], ZIF_HIZ_and_Conververter[7E]), Pin2 (bidir, see Muxes_and_ADC[7E], ZIF_HIZ_and_Conververter[7E]), Pin3 (bidir, see Muxes_and_ADC[7E], ZIF_HIZ_and_Conververter[7E]), Pin4 (bidir, see Muxes_and_ADC[7E], ZIF_HIZ_and_Conververter[7E]), Pin5 (bidir, see Muxes_and_ADC[7E], ZIF_HIZ_and_Conververter[7D]), Pin6 (bidir, see Muxes_and_ADC[7E], ZIF_HIZ_and_Conververter[7D]), Pin7 (bidir, see Muxes_and_ADC[7E], ZIF_HIZ_and_Conververter[7D]), Pin8 (bidir, see Muxes_and_ADC[7E], ZIF_HIZ_and_Conververter[7D]), Pin9 (bidir, see Muxes_and_ADC[7C], ZIF_HIZ_and_Conververter[7D]), Pin10 (bidir, see Muxes_and_ADC[7C], ZIF_HIZ_and_Conververter[7D]), Pin11 (bidir, see Muxes_and_ADC[7C], ZIF_HIZ_and_Conververter[7D]), Pin12 (bidir, see Muxes_and_ADC[7C], ZIF_HIZ_and_Conververter[7D]), Pin13 (bidir, see Muxes_and_ADC[7D], ZIF_HIZ_and_Conververter[7D]), Pin14 (bidir, see Muxes_and_ADC[7D], ZIF_HIZ_and_Conververter[7C]), Pin15 (bidir, see Muxes_and_ADC[7D], ZIF_HIZ_and_Conververter[7C]), Pin16 (bidir, see Muxes_and_ADC[7D], ZIF_HIZ_and_Conververter[7C]), Pin17 (bidir, see Muxes_and_ADC[7B], ZIF_HIZ_and_Conververter[7C]), Pin18 (bidir, see Muxes_and_ADC[7B], ZIF_HIZ_and_Conververter[7C]), Pin19 (bidir, see Muxes_and_ADC[7B], ZIF_HIZ_and_Conververter[7C]), Pin20 (bidir, see Muxes_and_ADC[7B], ZIF_HIZ_and_Conververter[7C])

### Nets
5V_ISO: U12.14(Y5) U13.14(Y5)  [also labelled 2Y5, Y5]
9V: C27.2 C28.2 C35.2 C36.2 U12.24(VDD) U13.24(VDD)
GND_ISO: C25.1 C25.2 C26.1 C26.2 C27.1 C28.1 C29.1 C30.1 C31.1 C31.2 C32.1 C32.2 C33.1 C34.1 C35.1 C36.1 U12.1(VSS) U12.16(Y7) U12.28(A0) U12.29(A1) U12.30(A2) U12.32(GND) U12.HTAB(EPAD) U13.1(VSS) U13.16(Y7) U13.29(A1) U13.30(A2) U13.32(GND) U13.HTAB(EPAD)
VDD: C29.2 C30.2 C33.2 C34.2 R20.2 R21.2 R22.2 R23.2 R24.2 R25.2 U12.25(VL) U13.25(VL) U13.28(A0)
2X0: U13.3(X0) ; port Pin16
2X1: U13.4(X1) ; port Pin15
2X2: U13.5(X2) ; port Pin14
2X3: U13.6(X3) ; port Pin13
2X4: U13.7(X4) ; port Pin12
2X5: U13.8(X5) ; port Pin11
2X6: U13.17(X6) ; port Pin20
2X7: U13.18(X7) ; port Pin19
2X8: U13.19(X8) ; port Pin18
2X9: U13.20(X9) ; port Pin17
2Y0: U12.9(Y0) U13.9(Y0) ; port 1.8V  [also labelled Y0]
2Y1: U12.10(Y1) U13.10(Y1) ; port 2.5V  [also labelled Y1]
2Y2: U12.11(Y2) U13.11(Y2) ; port 3.3V  [also labelled Y2]
2Y3: U12.12(Y3) U13.12(Y3) ; port 4V  [also labelled Y3]
2Y4: U12.13(Y4) U13.13(Y4) ; port 4.5V  [also labelled Y4]
2Y6: U12.15(Y6) U13.15(Y6) ; port CLK_F  [also labelled Y6]
X0: U12.3(X0) ; port Pin6
X1: U12.4(X1) ; port Pin5
X2: U12.5(X2) ; port Pin4
X3: U12.6(X3) ; port Pin3
X4: U12.7(X4) ; port Pin2
X5: U12.8(X5) ; port Pin1
X6: U12.17(X6) ; port Pin10
X7: U12.18(X7) ; port Pin9
X8: U12.19(X8) ; port Pin8
X9: U12.20(X9) ; port Pin7
NetR20_1: R20.1 U12.31(*RESET)
NetR21_1: R21.1 R24.1 U12.27(SCL) U13.27(SCL) ; port I2C1_SCL
NetR22_1: R22.1 R25.1 U12.26(SDA) U13.26(SDA) ; port I2C1_SDA
NetR23_1: R23.1 U13.31(*RESET)

Not connected (* = marked no-connect by the designer): U12 2(NC) 21(X10) 22(X11) 23(NC); U13 2(NC) 21(X10) 22(X11) 23(NC)

### Notes on the sheet
- DWG. NO.
- REV.
- SHT.
- THIS DOCUMENT AND THE DATA DISCLOSED HEREIN OR HEREWITH IS THE PROPERTY OF ALTIUM LIMITED AND MAY BE FREELY DISTRIBUTED IN WHOLE. NO RIGHTS ARE RESERVED OR EXPRESS OR IMPLIED WARANTEE GIVEN.
- REVISION
- DESCRIPTION
- DATE
- APPROVED
- ENG:
- APPROVALS
- PROJECT
- DSN:
- CHK:
- REFERENCE DOCUMENTS
- PROJECT REVISION:
- TITLE
- DOCUMENT REVISION:
- DESIGN ITEM:
- BOM:
- FAB DWG:
- PCB DWG:
- ASSY DWG:
- SCALE:
- SIZE
- B
- CAGE CODE
- FILE NAME
- DWG NO.
- SHEET
- OF
- REV

### Library data of the parts
C25 C28 C30 C32 C33 C36 = CMP-001-063486-1: CAP CER 10UF 35V X8M 1206; Part Number: GCM31CM8EG106KE08L
C26 C27 C29 C31 C34 C35 = CMP-001-063573-1: CAP CER 1206 0.1F 16V ULTRA STAB; Part Number: C1206X104G4HAC7800
R20 R23 = CMP-009-086150-1: RES 10K OHM 0.1% 1/4W 1206; Part Number: RP1206BRD0710KL
R21 R22 R24 R25 = CMP-009-093445-1: RES 2.2K OHM 10% 1/2W 1210; Part Number: SG732ETTD222K
U12 U13 = CMP-011-00018-1: I2C CMOS 8 X 12 Analog Switch Array with Dual/Single Supplies; Manufacturer_Name: Analog Devices Inc; Manufacturer_Part_Number: ADG2128BCPZ-REEL7; Component Type: Standard; Source: ADG2128BCPZ-REEL7.SchLib; Type: Type; Pins: 33; RefDes: RefDes; Copyright: Copyright (C) 2025 Ultra Librarian. All rights reserved.; Design Item ID: ADG2128BCPZ-REEL7

## Sheet Muxes_and_ADC.SchDoc: Multiplexers_and_ADC
size 431 x 279 mm; DrawnBy: Will Mensah; Organization: ORGANIZATION; Address1: ADDRESS 1; Address2: ADDRESS 2; Address3: ADDRESS 3; Address4: ADDRESS 4; Revision: -; SheetNumber: 4; SheetTotal: 6; ENG_APP_DATE: --/--/--; DSN_APP_DATE: --/--/--; CHK_APP_DATE: --/--/--
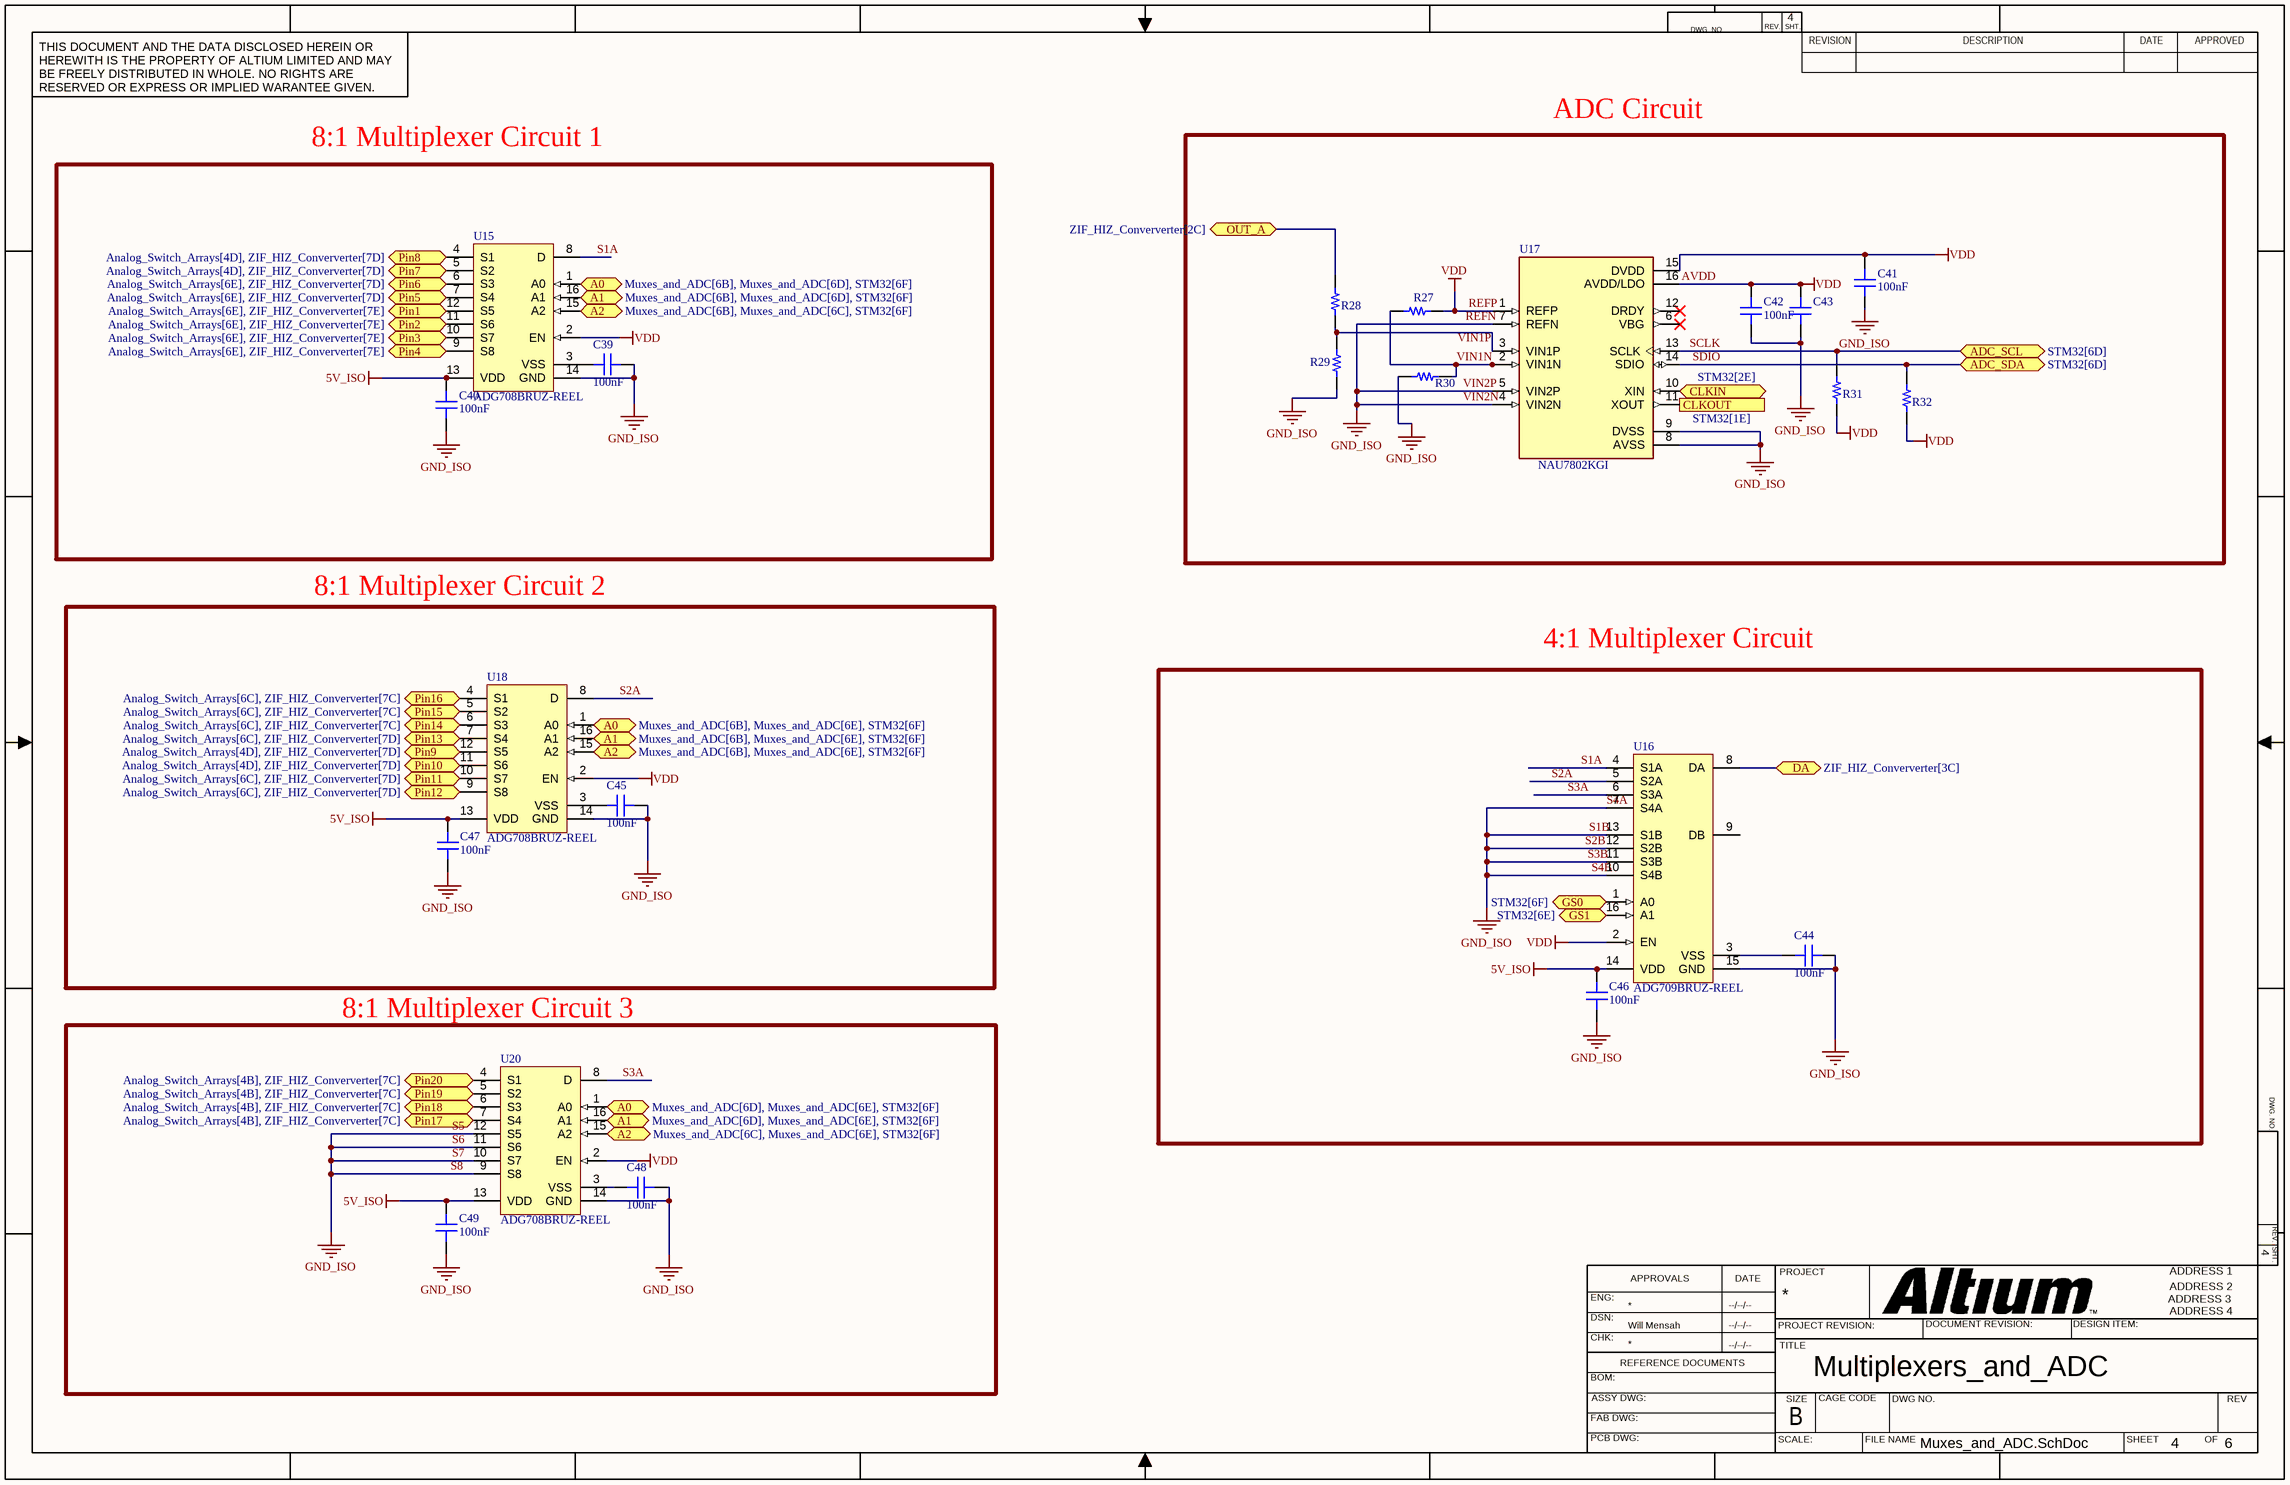
[diagram p3: Muxes_and_ADC.SchDoc]

### Parts
C39  value 100nF  [CAP 1206_3216 - 0.8MM]  (hidden comment: C1206X104G4HAC7800)
C40  value 100nF  [CAP 1206_3216 - 0.8MM]  (hidden comment: C1206X104G4HAC7800)
C41  value 100nF  [CAP 1206_3216 - 0.8MM]  (hidden comment: C1206X104G4HAC7800)
C42  value 100nF  [CAP 1206_3216 - 0.8MM]  (hidden comment: C1206X104G4HAC7800)
C43  C1206X104G4HAC7800  [CAP 1206_3216 - 0.8MM]  (value not drawn)
C44  value 100nF  [CAP 1206_3216 - 0.8MM]  (hidden comment: C1206X104G4HAC7800)
C45  value 100nF  [CAP 1206_3216 - 0.8MM]  (hidden comment: C1206X104G4HAC7800)
C46  value 100nF  [CAP 1206_3216 - 0.8MM]  (hidden comment: C1206X104G4HAC7800)
C47  value 100nF  [CAP 1206_3216 - 0.8MM]  (hidden comment: C1206X104G4HAC7800)
C48  value 100nF  [CAP 1206_3216 - 0.8MM]  (hidden comment: C1206X104G4HAC7800)
C49  value 100nF  [CAP 1206_3216 - 0.8MM]  (hidden comment: C1206X104G4HAC7800)
R27  TNPW120610K0BETY  [RES 1206_3216]  (value not drawn)
R28  TNPW120610K0BETY  [RES 1206_3216]  (value not drawn)
R29  TNPW120620K0BYEN  [RES 1206_3216]  (value not drawn)
R30  TNPW120610K0BETY  [RES 1206_3216]  (value not drawn)
R31  TNPW12064K70BEEA  [RES 1206_3216]  (value not drawn)
R32  TNPW12064K70BEEA  [RES 1206_3216]  (value not drawn)
U15  ADG708BRUZ-REEL  [ADI-RU-16_N]
U16  ADG709BRUZ-REEL  [ADI-RU-16_M]
U17  NAU7802KGI  [DIP792W45P254L1904H533Q16]
U18  ADG708BRUZ-REEL  [ADI-RU-16_N]
U20  ADG708BRUZ-REEL  [ADI-RU-16_N]

### Blocks framed on the sheet
8:1 Multiplexer Circuit 1: C39 C40 U15
ADC Circuit: C41-C43 R27-R32 U17
8:1 Multiplexer Circuit 2: C45 C47 U18
4:1 Multiplexer Circuit: C44 C46 U16
8:1 Multiplexer Circuit 3: C48 C49 U20

### Ports
A0 (bidir, see Muxes_and_ADC[6B], Muxes_and_ADC[6D], STM32[6F]), A0 (bidir, see Muxes_and_ADC[6B], Muxes_and_ADC[6E], STM32[6F]), A0 (bidir, see Muxes_and_ADC[6D], Muxes_and_ADC[6E], STM32[6F]), A1 (bidir, see Muxes_and_ADC[6B], Muxes_and_ADC[6D], STM32[6F]), A1 (bidir, see Muxes_and_ADC[6B], Muxes_and_ADC[6E], STM32[6F]), A1 (bidir, see Muxes_and_ADC[6D], Muxes_and_ADC[6E], STM32[6F]), A2 (bidir, see Muxes_and_ADC[6B], Muxes_and_ADC[6C], STM32[6F]), A2 (bidir, see Muxes_and_ADC[6B], Muxes_and_ADC[6E], STM32[6F]), A2 (bidir, see Muxes_and_ADC[6C], Muxes_and_ADC[6E], STM32[6F]), ADC_SCL (bidir, see STM32[6D]), ADC_SDA (bidir, see STM32[6D]), CLKIN (bidir, see STM32[2E]), CLKOUT (out, see STM32[1E]), DA (bidir, see ZIF_HIZ_Conververter[3C]), GS0 (bidir, see STM32[6F]), GS1 (bidir, see STM32[6E]), OUT_A (bidir, see ZIF_HIZ_Conververter[2C]), Pin1 (bidir, see Analog_Switch_Arrays[6E], ZIF_HIZ_Conververter[7E]), Pin2 (bidir, see Analog_Switch_Arrays[6E], ZIF_HIZ_Conververter[7E]), Pin3 (bidir, see Analog_Switch_Arrays[6E], ZIF_HIZ_Conververter[7E]), Pin4 (bidir, see Analog_Switch_Arrays[6E], ZIF_HIZ_Conververter[7E]), Pin5 (bidir, see Analog_Switch_Arrays[6E], ZIF_HIZ_Conververter[7D]), Pin6 (bidir, see Analog_Switch_Arrays[6E], ZIF_HIZ_Conververter[7D]), Pin7 (bidir, see Analog_Switch_Arrays[4D], ZIF_HIZ_Conververter[7D]), Pin8 (bidir, see Analog_Switch_Arrays[4D], ZIF_HIZ_Conververter[7D]), Pin9 (bidir, see Analog_Switch_Arrays[4D], ZIF_HIZ_Conververter[7D]), Pin10 (bidir, see Analog_Switch_Arrays[4D], ZIF_HIZ_Conververter[7D]), Pin11 (bidir, see Analog_Switch_Arrays[6C], ZIF_HIZ_Conververter[7D]), Pin12 (bidir, see Analog_Switch_Arrays[6C], ZIF_HIZ_Conververter[7D]), Pin13 (bidir, see Analog_Switch_Arrays[6C], ZIF_HIZ_Conververter[7D]), Pin14 (bidir, see Analog_Switch_Arrays[6C], ZIF_HIZ_Conververter[7C]), Pin15 (bidir, see Analog_Switch_Arrays[6C], ZIF_HIZ_Conververter[7C]), Pin16 (bidir, see Analog_Switch_Arrays[6C], ZIF_HIZ_Conververter[7C]), Pin17 (bidir, see Analog_Switch_Arrays[4B], ZIF_HIZ_Conververter[7C]), Pin18 (bidir, see Analog_Switch_Arrays[4B], ZIF_HIZ_Conververter[7C]), Pin19 (bidir, see Analog_Switch_Arrays[4B], ZIF_HIZ_Conververter[7C]), Pin20 (bidir, see Analog_Switch_Arrays[4B], ZIF_HIZ_Conververter[7C])

### Nets
5V_ISO: C40.2 C46.1 C47.1 C49.1 U15.13(VDD) U16.14(VDD) U18.13(VDD) U20.13(VDD)
GND_ISO: C39.1 C40.1 C41.2 C42.2 C43.2 C44.1 C45.1 C46.2 C47.2 C48.1 C49.2 R29.1 R30.2 U15.14(GND) U16.7(S4A) U16.10(S4B) U16.11(S3B) U16.12(S2B) U16.13(S1B) U16.15(GND) U17.4(VIN2N) U17.5(VIN2P) U17.7(REFN) U17.8(AVSS) U17.9(DVSS) U18.14(GND) U20.9(S8) U20.10(S7) U20.11(S6) U20.12(S5) U20.14(GND)  [also labelled REFN, S1B, S2B, S3B, S4A, S4B, S5, S6, S7, S8, VIN2N, VIN2P]
VDD: C41.1 C42.1 C43.1 R27.1 R31.1 R32.1 U15.2(EN) U16.2(EN) U17.1(REFP) U17.15(DVDD) U17.16(AVDD/LDO) U18.2(EN) U20.2(EN)  [also labelled AVDD, REFP]
2X0: U18.4(S1) ; port Pin16
2X1: U18.5(S2) ; port Pin15
2X2: U18.6(S3) ; port Pin14
2X3: U18.7(S4) ; port Pin13
2X4: U18.9(S8) ; port Pin12
2X5: U18.10(S7) ; port Pin11
2X6: U20.4(S1) ; port Pin20
2X7: U20.5(S2) ; port Pin19
2X8: U20.6(S3) ; port Pin18
2X9: U20.7(S4) ; port Pin17
OSC_IN: U17.10(XIN) ; port CLKIN
OSC_OUT: U17.11(XOUT) ; port CLKOUT
S1A: U15.8(D) U16.4(S1A)
S2A: U16.5(S2A) U18.8(D)
S3A: U16.6(S3A) U20.8(D)
SCLK: R31.2 U17.13(SCLK) ; port ADC_SCL
SDIO: R32.2 U17.14(SDIO) ; port ADC_SDA
VIN1N: R27.2 R30.1 U17.2(VIN1N)
X0: U15.6(S3) ; port Pin6
X1: U15.7(S4) ; port Pin5
X2: U15.9(S8) ; port Pin4
X3: U15.10(S7) ; port Pin3
X4: U15.11(S6) ; port Pin2
X5: U15.12(S5) ; port Pin1
X6: U18.11(S6) ; port Pin10
X7: U18.12(S5) ; port Pin9
X8: U15.4(S1) ; port Pin8
X9: U15.5(S2) ; port Pin7
NetC39_2: C39.2 U15.3(VSS)
NetC44_2: C44.2 U16.3(VSS)
NetC45_2: C45.2 U18.3(VSS)
NetC48_2: C48.2 U20.3(VSS)
NetR28_1: R28.1 R29.2 U17.3(VIN1P)
NetR28_2: R28.2 ; port OUT_A
NetU9_18: U15.1(A0) U18.1(A0) U20.1(A0) ; port A0
NetU9_19: U15.16(A1) U18.16(A1) U20.16(A1) ; port A1
NetU9_20: U15.15(A2) U18.15(A2) U20.15(A2) ; port A2
NetU9_21: U16.1(A0) ; port GS0
NetU9_22: U16.16(A1) ; port GS1
NetU16_8: U16.8(DA) ; port DA

Not connected (* = marked no-connect by the designer): U16 9(DB); U17 6(VBG)* 12(DRDY)*

### Notes on the sheet
- Labels drawn without touching a wire or pin: VIN1P
- DWG. NO.
- REV.
- SHT.
- THIS DOCUMENT AND THE DATA DISCLOSED HEREIN OR HEREWITH IS THE PROPERTY OF ALTIUM LIMITED AND MAY BE FREELY DISTRIBUTED IN WHOLE. NO RIGHTS ARE RESERVED OR EXPRESS OR IMPLIED WARANTEE GIVEN.
- REVISION
- DESCRIPTION
- DATE
- APPROVED
- ENG:
- APPROVALS
- PROJECT
- DSN:
- CHK:
- REFERENCE DOCUMENTS
- PROJECT REVISION:
- TITLE
- DOCUMENT REVISION:
- DESIGN ITEM:
- BOM:
- FAB DWG:
- PCB DWG:
- ASSY DWG:
- SCALE:
- SIZE
- B
- CAGE CODE
- FILE NAME
- DWG NO.
- SHEET
- OF
- REV

### Library data of the parts
C39-C49 = CMP-001-063573-1: CAP CER 1206 0.1F 16V ULTRA STAB; Part Number: C1206X104G4HAC7800
R27 R28 R30 = CMP-009-078908-1: RES 10K OHM 0.1% 1/4W 1206; Part Number: TNPW120610K0BETY
R29 = CMP-009-083572-1: RES 20K OHM 0.1% 1/4W 1206; Part Number: TNPW120620K0BYEN
R31 R32 = CMP-009-078373-1: RES 4.7K OHM 0.1% 1/4W 1206; Part Number: TNPW12064K70BEEA
U15 U18 U20 = CMP-0798-00195-1: as U10 on sheet STM32; ComponentLink1URL: http://www.analog.com/en/index.html; ComponentLink3Description: Package Specification; Code_JEDEC: MO-153AB; ComponentLink2URL: http://www.analog.com/static/imported-files/data_sheets/ADG708_709.pdf; Packing: Reel; ComponentLink3URL: http:/www.analog.com/static/imported-files/packages/36244347913743854010197452789RU16.pdf; PackageVersion: Nov-02; ComponentLink2Description: Datasheet; ComponentLink1Description: Manufacturer URL; PackageReference: RU-16; DatasheetVersion: Rev. C; PackageDescription: 16-Pin Thin Shrink Small Outline Package, Body 5 x 4.4 mm, Pitch 0.65 mm; PartNumber: ADG708BRUZ-REEL; Mounting Technology: Surface Mount
U16 = CMP-0798-00149-1: 1.8 to 5.5 V / +/-2.5 V, CMOS Low Voltage 3 Ohm, 4-Channel Multiplexer, -40 to 125 degC, 16-pin SOP (RU-16), Reel; Manufacturer: Analog Devices; Ron (ohms): 3; Supply V Guar Performance: Dual_(+/-2.5V), Single_(+3V), Single_(+5V); t transition (s): 14n; Max Analog Signal Range: Vss to Vdd; Bandwidth (Hz): 55M; Mounting Technology: Surface Mount; ComponentLink3URL: http:/www.analog.com/static/imported-files/packages/36244347913743854010197452789RU16.pdf; ComponentLink1Description: Manufacturer URL; PackageVersion: Nov-02; PackageDescription: 16-Pin Thin Shrink Small Outline Package, Body 5 x 4.4 mm, Pitch 0.65 mm; PartNumber: ADG709BRUZ-REEL; ComponentLink3Description: Package Specification; DatasheetVersion: Rev. C; ComponentLink2URL: http://www.analog.com/static/imported-files/data_sheets/ADG708_709.pdf; Code_JEDEC: MO-153AB; ComponentLink2Description: Datasheet; ComponentLink1URL: http://www.analog.com/en/index.html; PackageReference: RU-16; Packing: Reel
U17 = CMP-00256-1: 24 Bit Analog to Digital Converter 2 Input 1 Sigma-Delta 16-PDIP; MF: Nuvoton Technology Corporation of America; Component Type: Standard; Source: NAU7802KGI.SchLib; Design Item ID: NAU7802KGI; Package: Package; SnapEDA_Link: https://www.snapeda.com/parts/NAU7802KGI/Nuvoton/view-part/?ref=snap; Check_prices: https://www.snapeda.com/parts/NAU7802KGI/Nuvoton/view-part/?ref=eda; Value: *; MP: NAU7802KGI; Pin Count: 16

## Sheet Voltage_Reference_Circuit.SchDoc
size 431 x 279 mm; Organization: ORGANIZATION; Address1: ADDRESS 1; Address2: ADDRESS 2; Address3: ADDRESS 3; Address4: ADDRESS 4; Revision: -; SheetNumber: 5; SheetTotal: 6; ENG_APP_DATE: --/--/--; DSN_APP_DATE: --/--/--; CHK_APP_DATE: --/--/--
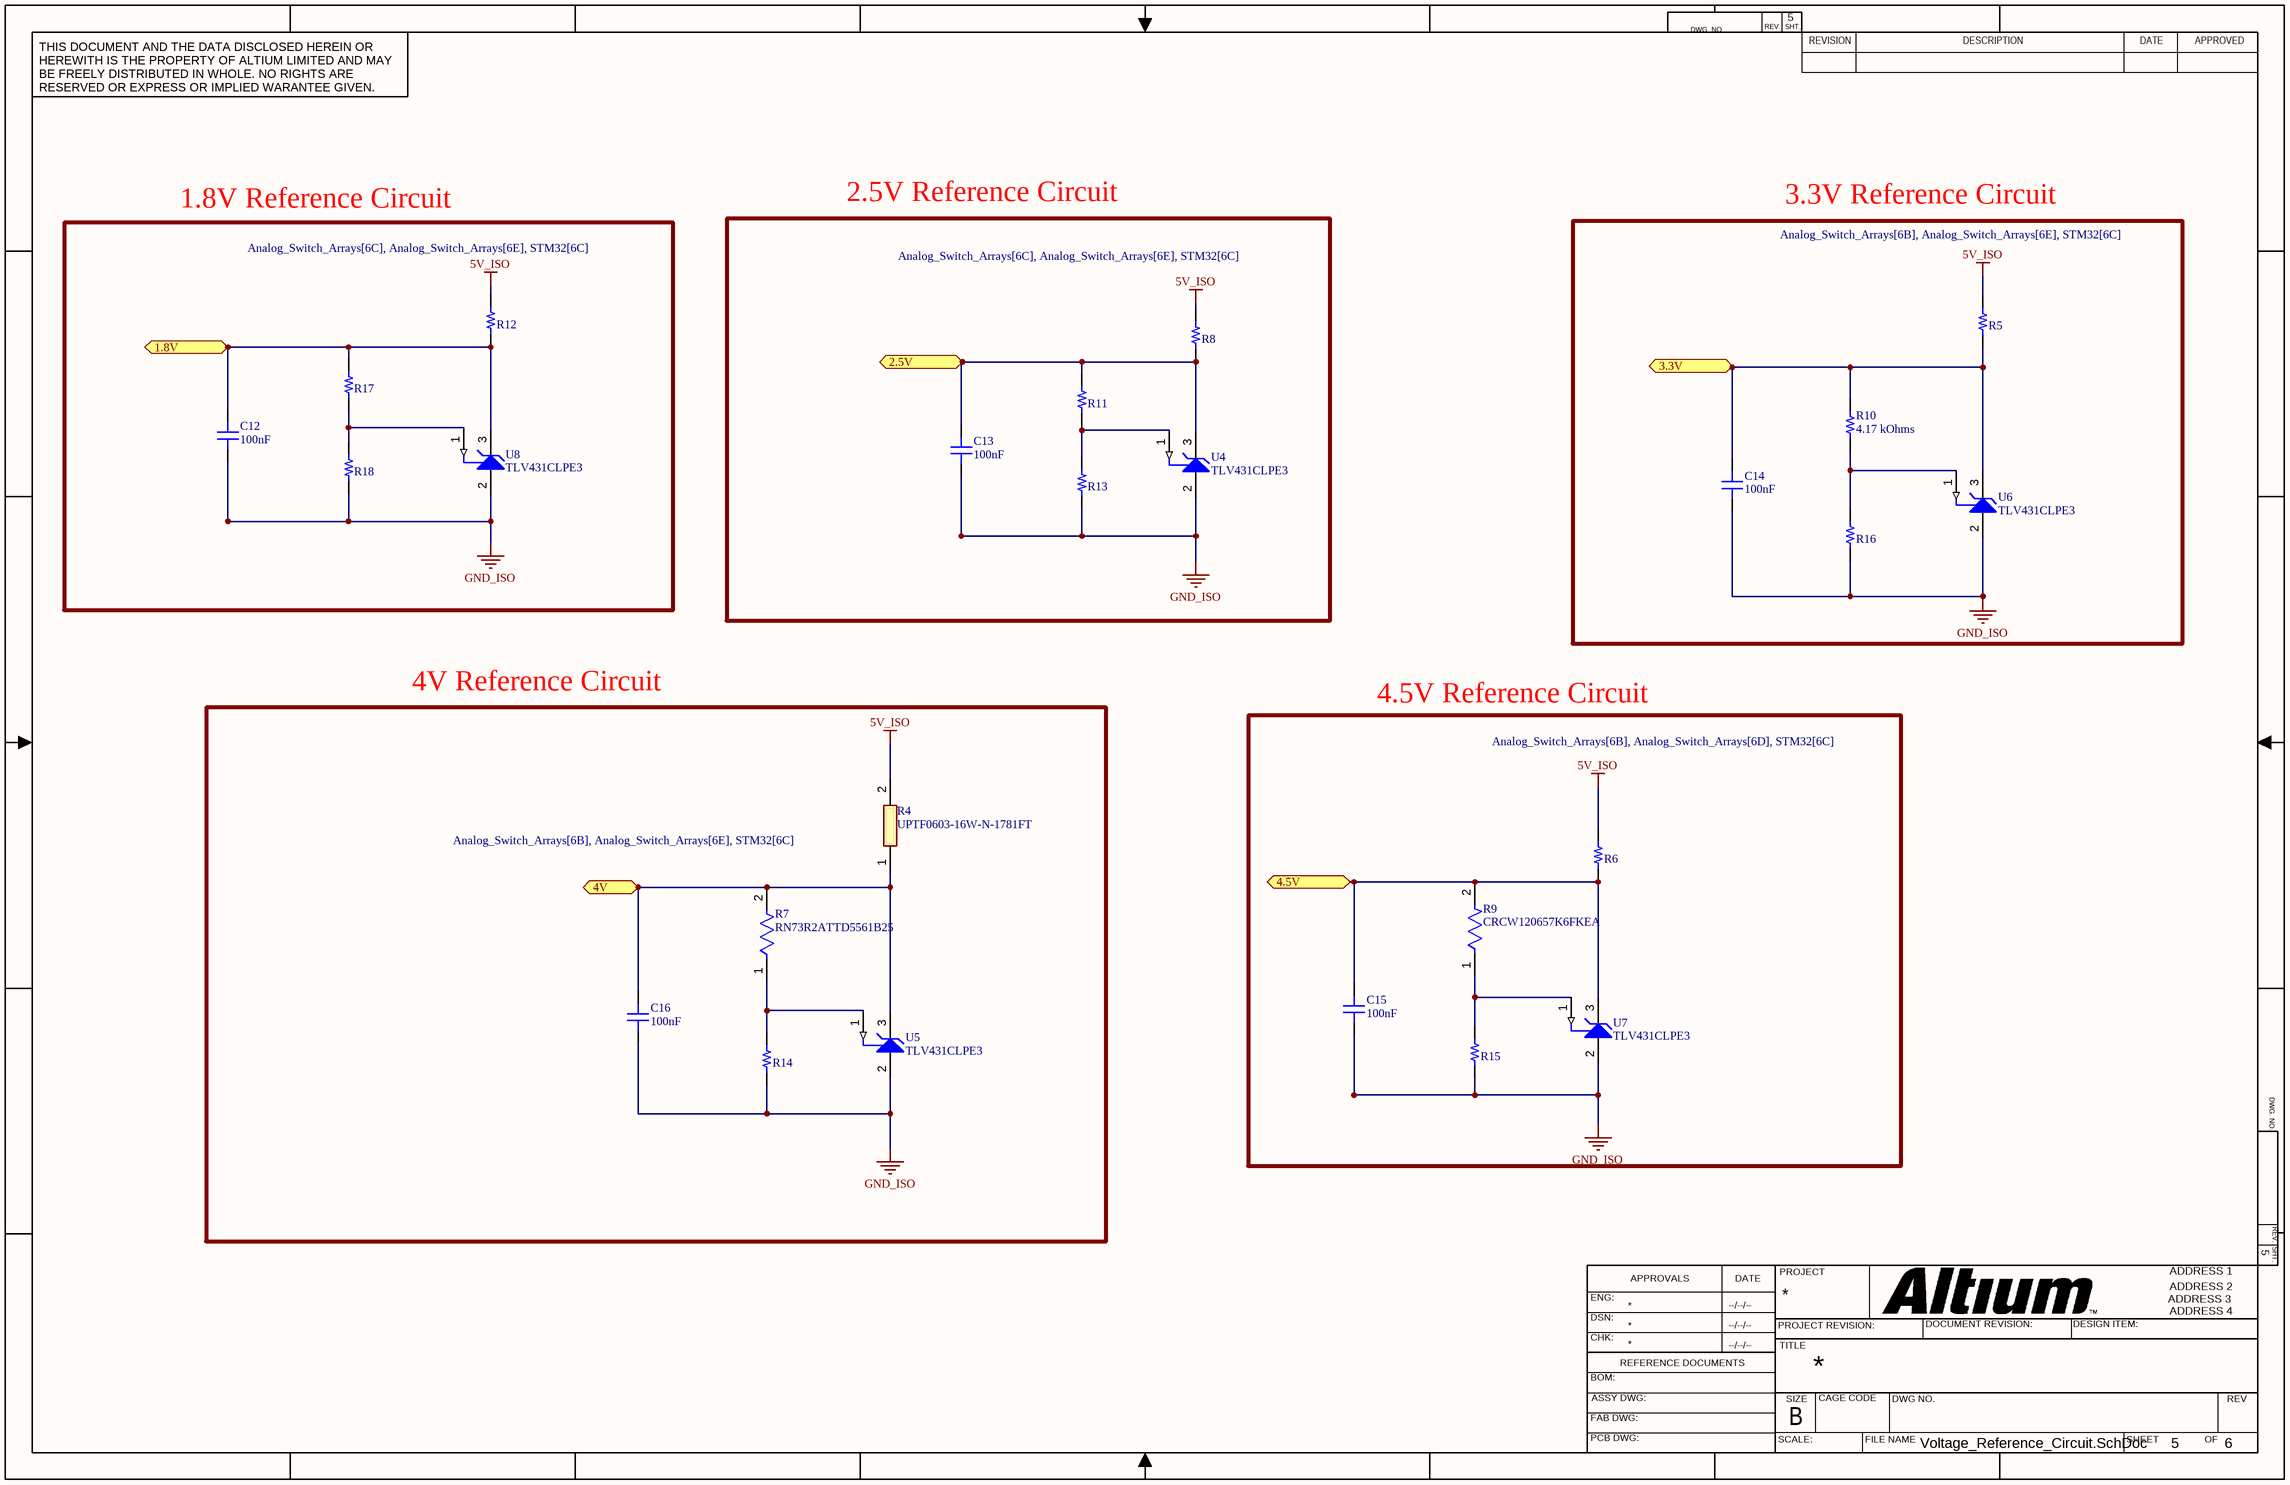
[diagram p4: Voltage_Reference_Circuit.SchDoc]

### Parts
C12  value 100nF  [CAP 1206_3216 - 0.8MM]  (hidden comment: VJ1206Y104KXXAC)
C13  value 100nF  [CAP 1206_3216 - 0.8MM]  (hidden comment: VJ1206Y104KXXAC)
C14  value 100nF  [CAP 1206_3216 - 0.8MM]  (hidden comment: VJ1206Y104KXXAC)
C15  value 100nF  [CAP 1206_3216 - 0.8MM]  (hidden comment: VJ1206Y104KXXAC)
C16  value 100nF  [CAP 1206_3216 - 0.8MM]  (hidden comment: VJ1206Y104KXXAC)
R4  UPTF0603-16W-N-1781FT  [RESC1608X55N]
R5  RQ73C2B1K69BTD  [RES 1206_3216]  (value not drawn)
R6  RT1206BRD07442RL  [YAGEO RES 1206_3216]  (value not drawn)
R7  RN73R2ATTD5561B25  [FP-RN73R2A-IPC_C]
R8  KTR18EZPF2491  [RES 1206_3216]  (value not drawn)
R9  CRCW120657K6FKEA  [FP-CRCW1206-e3-IPC_B]
R10  value 4.17 kOhms  [KOA RES RK73 RN73 0603_1608]  (hidden comment: RN73R1JTTD4171B25)
R11  RT1206BRD072K55L  [YAGEO RES 1206_3216]  (value not drawn)
R12  KTR18EZPF2491  [RES 1206_3216]  (value not drawn)
R13  KTR18EZPF2491  [RES 1206_3216]  (value not drawn)
R14  KTR18EZPF2491  [RES 1206_3216]  (value not drawn)
R15  KTR18EZPF2491  [RES 1206_3216]  (value not drawn)
R16  KTR18EZPF2491  [RES 1206_3216]  (value not drawn)
R17  RK73H2BTTD1131F  [RES 1206_3216]  (value not drawn)
R18  KTR18EZPF2491  [RES 1206_3216]  (value not drawn)
U4  TLV431CLPE3  [TI-LP3]
U5  TLV431CLPE3  [TI-LP3]
U6  TLV431CLPE3  [TI-LP3]
U7  TLV431CLPE3  [TI-LP3]
U8  TLV431CLPE3  [TI-LP3]

### Blocks framed on the sheet
2.5V Reference Circuit: C13 R8 R11 R13 U4
1.8V Reference Circuit: C12 R12 R17 R18 U8
3.3V Reference Circuit: C14 R5 R10 R16 U6
4V Reference Circuit: C16 R4 R7 R14 U5
4.5V Reference Circuit: C15 R6 R9 R15 U7

### Ports
1.8V (bidir, see Analog_Switch_Arrays[6C], Analog_Switch_Arrays[6E], STM32[6C]), 2.5V (bidir, see Analog_Switch_Arrays[6C], Analog_Switch_Arrays[6E], STM32[6C]), 3.3V (bidir, see Analog_Switch_Arrays[6B], Analog_Switch_Arrays[6E], STM32[6C]), 4.5V (bidir, see Analog_Switch_Arrays[6B], Analog_Switch_Arrays[6D], STM32[6C]), 4V (bidir, see Analog_Switch_Arrays[6B], Analog_Switch_Arrays[6E], STM32[6C])

### Nets
5V_ISO: R4.2 R5.2 R6.2 R8.2 R12.2
GND_ISO: C12.1 C13.1 C14.1 C15.1 C16.1 R13.1 R14.1 R15.1 R16.1 R18.1 U4.2(ANODE) U5.2(ANODE) U6.2(ANODE) U7.2(ANODE) U8.2(ANODE)
2Y0: C12.2 R12.1 R17.2 U8.3(CATHODE) ; port 1.8V
2Y1: C13.2 R8.1 R11.2 U4.3(CATHODE) ; port 2.5V
2Y2: C14.2 R5.1 R10.2 U6.3(CATHODE) ; port 3.3V
2Y3: C16.2 R4.1 R7.2 U5.3(CATHODE) ; port 4V
2Y4: C15.2 R6.1 R9.2 U7.3(CATHODE) ; port 4.5V
NetR7_1: R7.1 R14.2 U5.1(REF)
NetR9_1: R9.1 R15.2 U7.1(REF)
NetR10_1: R10.1 R16.2 U6.1(REF)
NetR11_1: R11.1 R13.2 U4.1(REF)
NetR17_1: R17.1 R18.2 U8.1(REF)

### Notes on the sheet
- DWG. NO.
- REV.
- SHT.
- THIS DOCUMENT AND THE DATA DISCLOSED HEREIN OR HEREWITH IS THE PROPERTY OF ALTIUM LIMITED AND MAY BE FREELY DISTRIBUTED IN WHOLE. NO RIGHTS ARE RESERVED OR EXPRESS OR IMPLIED WARANTEE GIVEN.
- REVISION
- DESCRIPTION
- DATE
- APPROVED
- ENG:
- APPROVALS
- PROJECT
- DSN:
- CHK:
- REFERENCE DOCUMENTS
- PROJECT REVISION:
- TITLE
- DOCUMENT REVISION:
- DESIGN ITEM:
- BOM:
- FAB DWG:
- PCB DWG:
- ASSY DWG:
- SCALE:
- SIZE
- B
- CAGE CODE
- FILE NAME
- DWG NO.
- SHEET
- OF
- REV

### Library data of the parts
C12-C16 = CMP-001-062189-1: CAP CER 0.1UF 25V X7R 1206; Part Number: VJ1206Y104KXXAC
R4 = UPTF0603-16W-N-1781FT: Resistor; Manufacturer_Name: Venkel; Datasheet Link: https://page.venkel.com/hubfs/Resources/Datasheets/UPTF-Series.pdf; Height: 0.55mm; Manufacturer_Part_Number: UPTF0603-16W-N-1781FT
R5 = CMP-009-075815-1: RES 1.69 KOHMS 0.1% 0.4W 1206; Part Number: RQ73C2B1K69BTD
R6 = CMP-009-090039-1: RES SMD 442 OHM 0.1% 1/4W 1206; Part Number: RT1206BRD07442RL
R7 = CMP-04015-006256-1: 5.56kΩ ±0.1% 0.125W, 1/8W Chip Resistor 0805 (2012 Metric) Moisture Resistant Thin Film
R8 R12-R16 R18 = CMP-009-080149-1: RES SMD 2.49K OHM 1% 1/4W 1206; Part Number: KTR18EZPF2491
R9 = CMP-2003-02290-2: RES Thick Film, 57.6kΩ, 1%, 0.25W, 100ppm/°C, 1206; Resistance: 57.6kR; Power Rating: 250mW; Voltage Rating: 200V; Number of Pins: 2; Case/Package: 1206; Max Operating Temperature: 155°C; Min Operating Temperature: -55°C; Case Code (Imperial): 1206; Case Code (Metric): 3216; Temperature Coefficient: 100ppm/°C; Features: Automotive AEC-Q200; Packaging: Tape and Reel; Number of Terminations: 2; Military Standard: Not; Length: 3.2mm; Weight: 0.000353oz; Height: 0.55mm; Width: 0.063inch; Height - Seated (Max): 0.024inch; Voltage Rating (DC): 200V; Radiation Hardening: No; Composition: Thick Film; Package Quantity: 5000; Contact Plating: Tin; Tolerance: 1%; Lead Free: Lead Free; Max Power Dissipation: 250mW; Depth: 1.6mm
R10 = CMP-009-044138-1: RES 4.17K OHM 0.1% 1/10W 0603; Part Number: RN73R1JTTD4171B25
R11 = CMP-009-083477-1: RES SMD 2.55K OHM 0.1% 1/4W 1206; Part Number: RT1206BRD072K55L
R17 = CMP-009-082226-1: RES 1.13K OHM 1% 1/4W 1206; Part Number: RK73H2BTTD1131F
U4-U8 = CMP-0366-00210-1: Low Voltage Adjustable Precision Shunt Regulator, 39 ppm / degC, 15 mA, 0 to 70 degC, 3-pin TO-92 (LP), Pb-Free (RoHS); Manufacturer: Texas Instruments; Eco-Plan: Green (RoHS & no Sb/Br); Iout/Iz(Max)(mA): 15; VO Adj(Max)(V): 6; Min Iz for Regulation(uA): 80; SubFamily: Shunt Voltage Reference; VO Adj(Min)(V): 1.24; Rating: Catalog; Temp Coeff(Typ)(ppm/ degree C): 39; Initial Accuracy @ 25/deg C(%): 1.5; Temp Coeff(Max)(ppm/ degree C): 129; PackageReference: LP3; PackageDescription: Plastic Cylindrical Package, Formed Lead Option (TO-92); ComponentLink2URL: http://www.ti.com/general/docs/lit/getliterature.tsp?genericPartNumber=TLV431&fileType=pdf; ComponentLink2Description: Datasheet; ComponentLink3Description: Package Specification; ComponentLink1URL: http://www.ti.com/; PartNumber: TLV431CLPE3; PackageVersion: 4040001-2/C; Code_JEDEC: TO-226; ComponentLink3URL: http://www.ti.com/litv/pdf/msot002a; DatasheetVersion: SLVS139T; ComponentLink1Description: Manufacturer URL; Mounting Technology: Through Hole

## Nets that join several sheets
5V_ISO: USB_to_UART (12 pins), STM32 (C22.1 U10.11 U10.13), Analog_Switch_Arrays (U12.14 U13.14), Muxes_and_ADC (8 pins), Voltage_Reference_Circuit (5 pins)
GND_ISO: USB_to_UART (21 pins), STM32 (17 pins), Analog_Switch_Arrays (29 pins), Muxes_and_ADC (31 pins), Voltage_Reference_Circuit (15 pins)
VDD: USB_to_UART (6 pins), STM32 (7 pins), Analog_Switch_Arrays (13 pins), Muxes_and_ADC (13 pins)
2X0: Analog_Switch_Arrays (U13.3), Muxes_and_ADC (U18.4)
2X1: Analog_Switch_Arrays (U13.4), Muxes_and_ADC (U18.5)
2X2: Analog_Switch_Arrays (U13.5), Muxes_and_ADC (U18.6)
2X3: Analog_Switch_Arrays (U13.6), Muxes_and_ADC (U18.7)
2X4: Analog_Switch_Arrays (U13.7), Muxes_and_ADC (U18.9)
2X5: Analog_Switch_Arrays (U13.8), Muxes_and_ADC (U18.10)
2X6: Analog_Switch_Arrays (U13.17), Muxes_and_ADC (U20.4)
2X7: Analog_Switch_Arrays (U13.18), Muxes_and_ADC (U20.5)
2X8: Analog_Switch_Arrays (U13.19), Muxes_and_ADC (U20.6)
2X9: Analog_Switch_Arrays (U13.20), Muxes_and_ADC (U20.7)
2Y0: STM32 (U10.4), Analog_Switch_Arrays (U12.9 U13.9), Voltage_Reference_Circuit (C12.2 R12.1 R17.2 U8.3)
2Y1: STM32 (U10.5), Analog_Switch_Arrays (U12.10 U13.10), Voltage_Reference_Circuit (C13.2 R8.1 R11.2 U4.3)
2Y2: STM32 (U10.6), Analog_Switch_Arrays (U12.11 U13.11), Voltage_Reference_Circuit (C14.2 R5.1 R10.2 U6.3)
2Y3: STM32 (U10.7), Analog_Switch_Arrays (U12.12 U13.12), Voltage_Reference_Circuit (C16.2 R4.1 R7.2 U5.3)
2Y4: STM32 (U10.12), Analog_Switch_Arrays (U12.13 U13.13), Voltage_Reference_Circuit (C15.2 R6.1 R9.2 U7.3)
2Y6: STM32 (U11.4), Analog_Switch_Arrays (U12.15 U13.15)
NetR21_1: STM32 (U9.60), Analog_Switch_Arrays (R21.1 R24.1 U12.27 U13.27)
NetR22_1: STM32 (U9.61), Analog_Switch_Arrays (R22.1 R25.1 U12.26 U13.26)
NetU9_18: STM32 (U9.18), Muxes_and_ADC (U15.1 U18.1 U20.1)
NetU9_19: STM32 (U9.19), Muxes_and_ADC (U15.16 U18.16 U20.16)
NetU9_20: STM32 (U9.20), Muxes_and_ADC (U15.15 U18.15 U20.15)
NetU9_21: STM32 (U9.21), Muxes_and_ADC (U16.1)
NetU9_22: STM32 (U9.22), Muxes_and_ADC (U16.16)
OSC_IN: STM32 (C17.2 U9.10 Y1.1), Muxes_and_ADC (U17.10)
OSC_OUT: STM32 (C18.1 U9.11 Y1.3), Muxes_and_ADC (U17.11)
RXD: USB_to_UART (D1.2 U3.25), STM32 (U9.37)
SCLK: STM32 (U9.30), Muxes_and_ADC (R31.2 U17.13)
SDIO: STM32 (U9.31), Muxes_and_ADC (R32.2 U17.14)
TXD: USB_to_UART (D2.2 U3.26), STM32 (U9.42)
X0: Analog_Switch_Arrays (U12.3), Muxes_and_ADC (U15.6)
X1: Analog_Switch_Arrays (U12.4), Muxes_and_ADC (U15.7)
X2: Analog_Switch_Arrays (U12.5), Muxes_and_ADC (U15.9)
X3: Analog_Switch_Arrays (U12.6), Muxes_and_ADC (U15.10)
X4: Analog_Switch_Arrays (U12.7), Muxes_and_ADC (U15.11)
X5: Analog_Switch_Arrays (U12.8), Muxes_and_ADC (U15.12)
X6: Analog_Switch_Arrays (U12.17), Muxes_and_ADC (U18.11)
X7: Analog_Switch_Arrays (U12.18), Muxes_and_ADC (U18.12)
X8: Analog_Switch_Arrays (U12.19), Muxes_and_ADC (U15.4)
X9: Analog_Switch_Arrays (U12.20), Muxes_and_ADC (U15.5)